# EAGLE board RFMicronHermes_1_1 (EAGLE 7.6.0), part 1 of 2
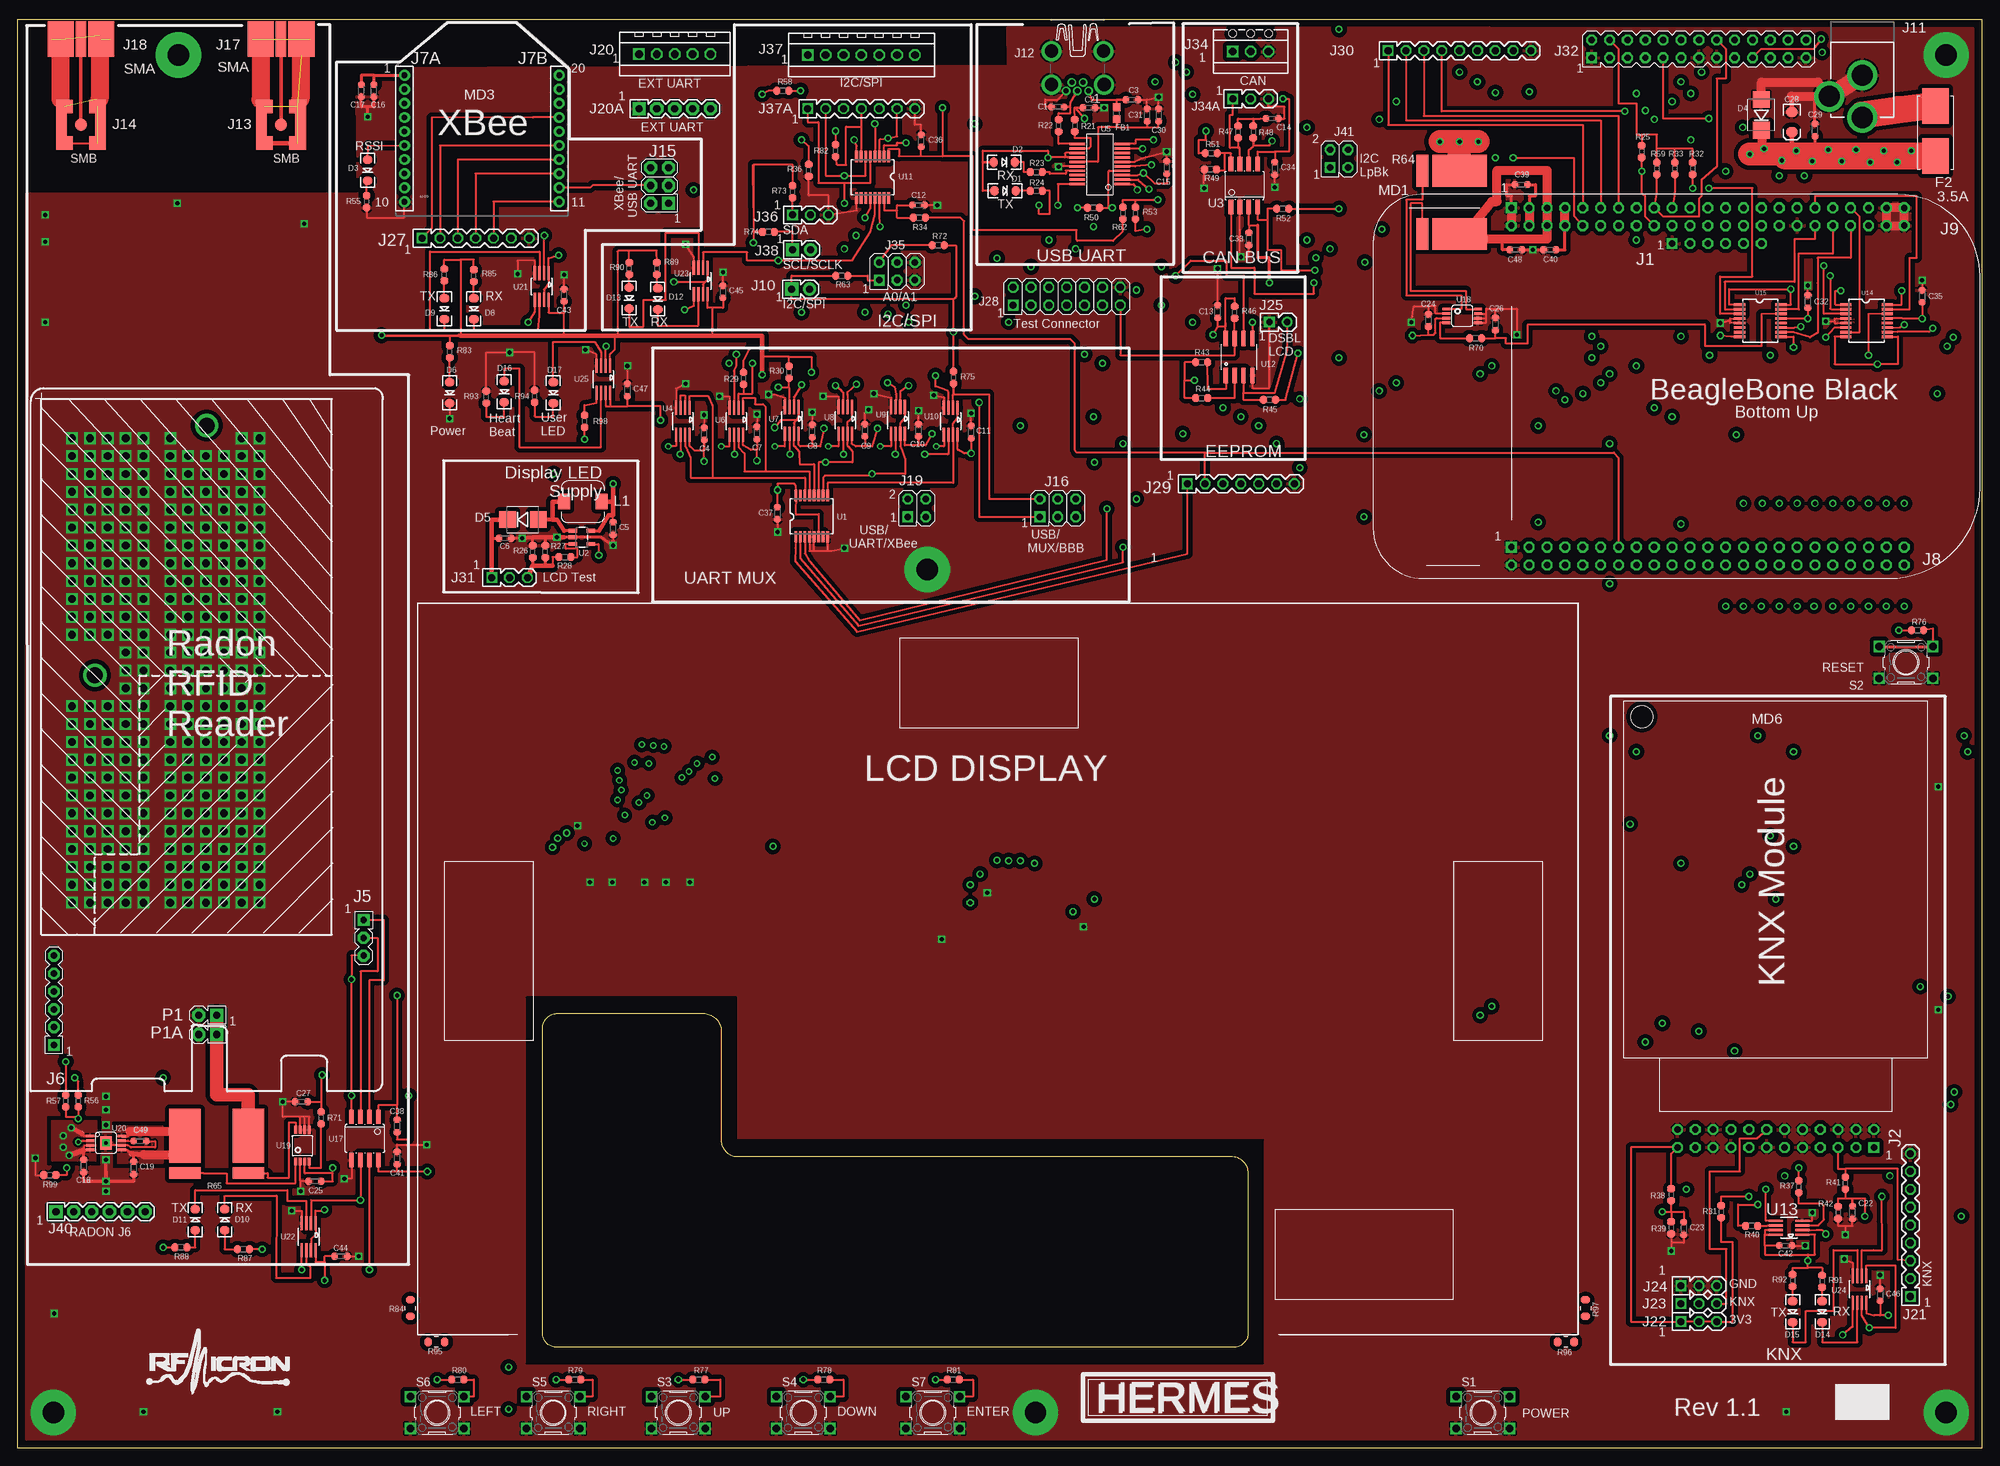
[diagram p9: board, top side]
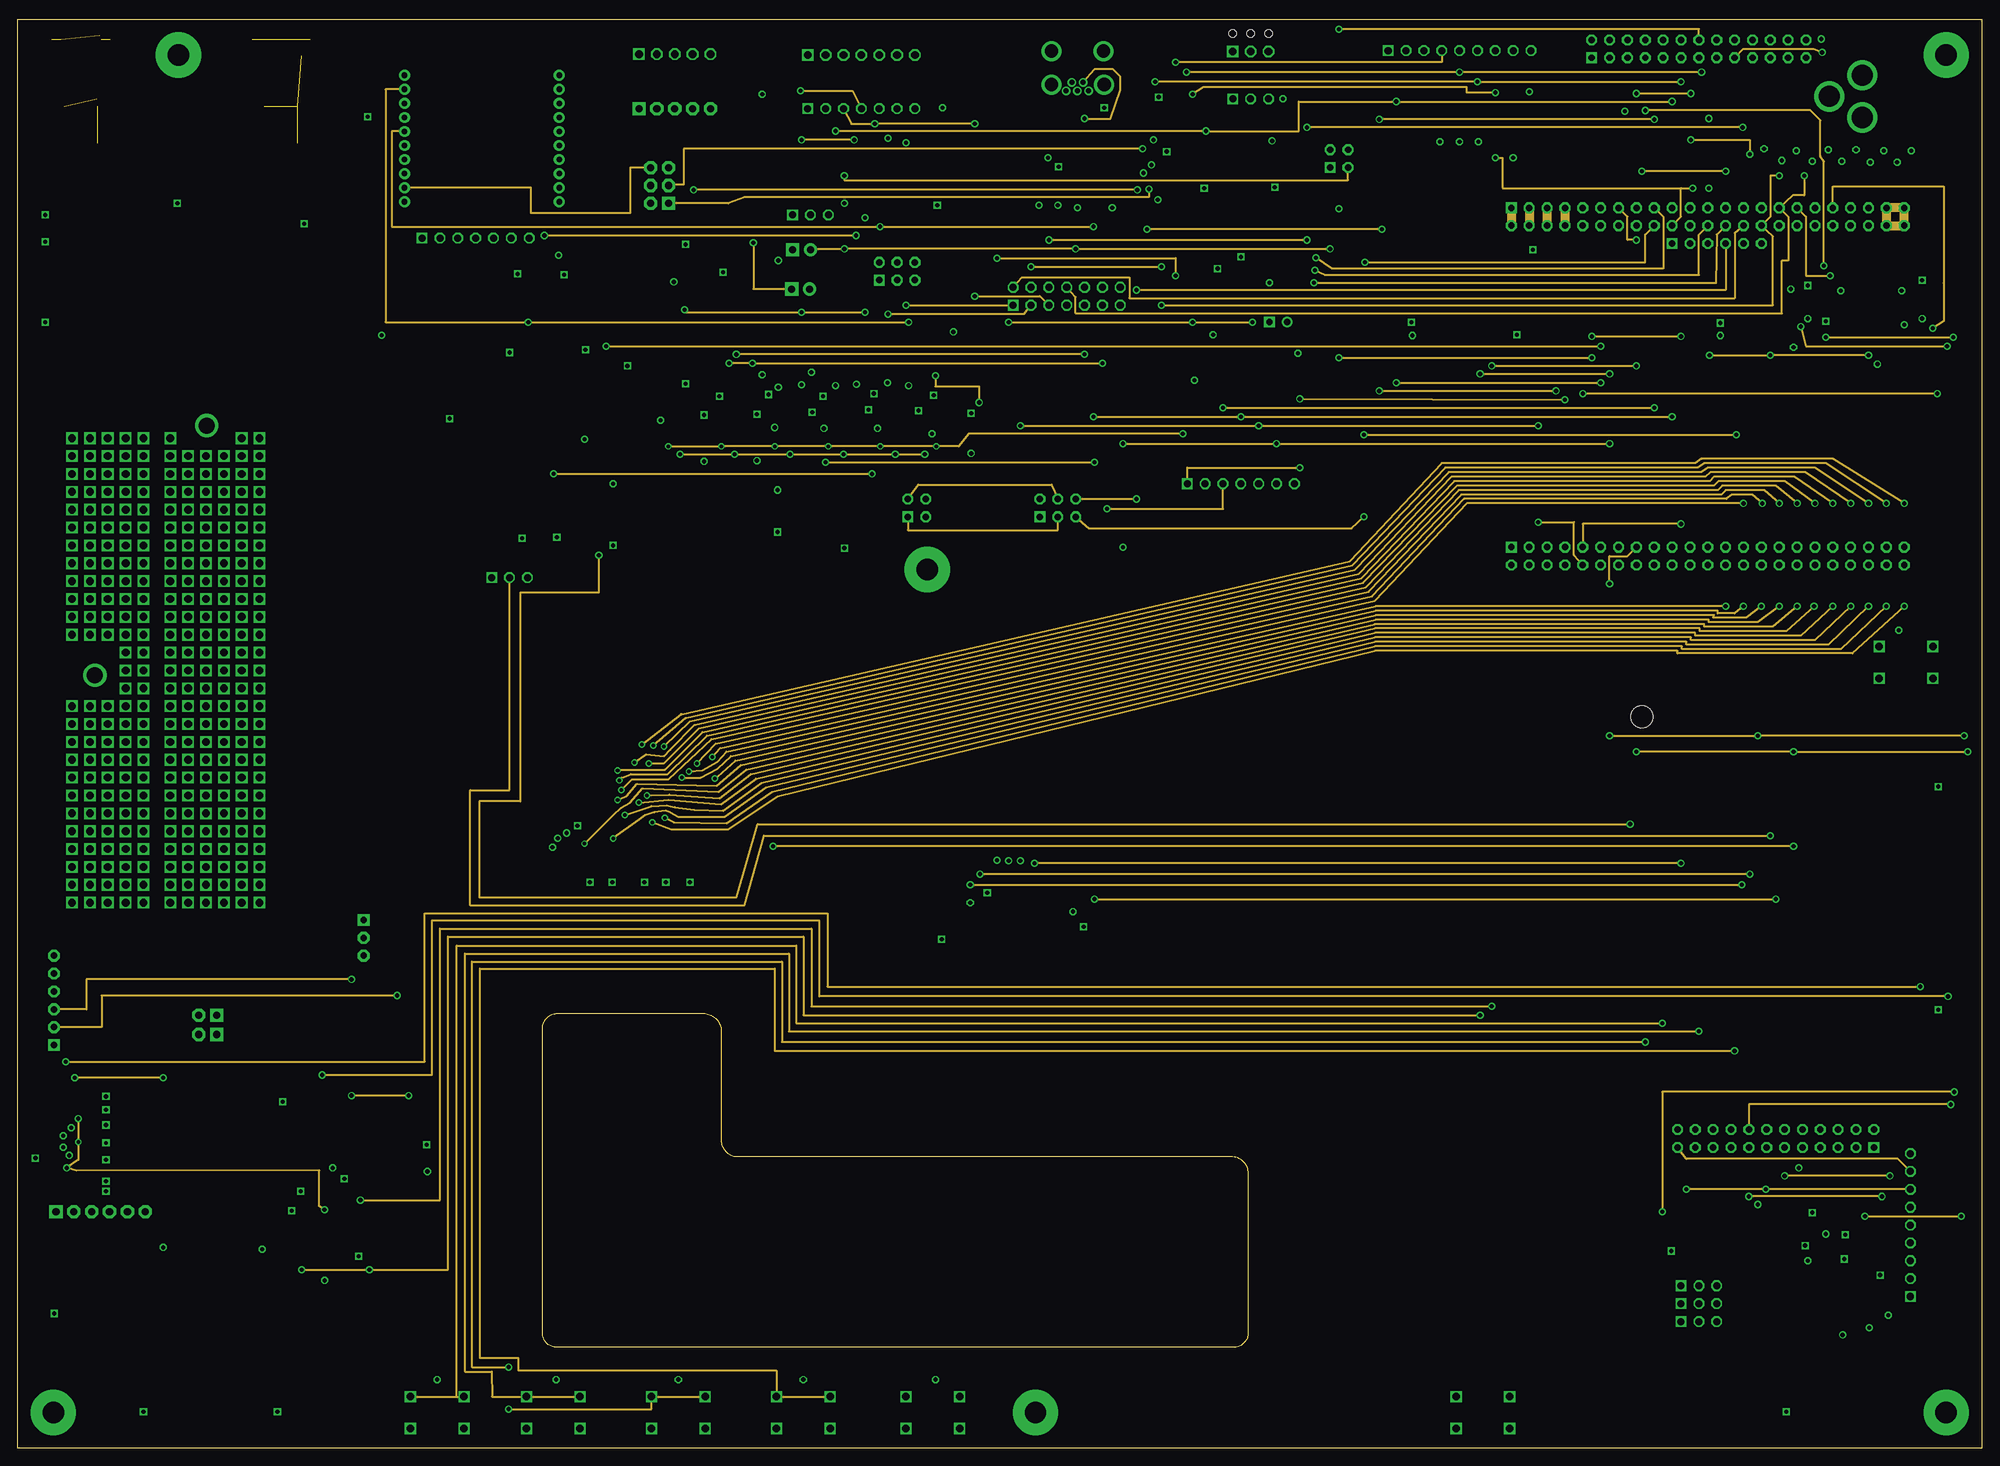
[diagram p10: board, inner layer SI1]
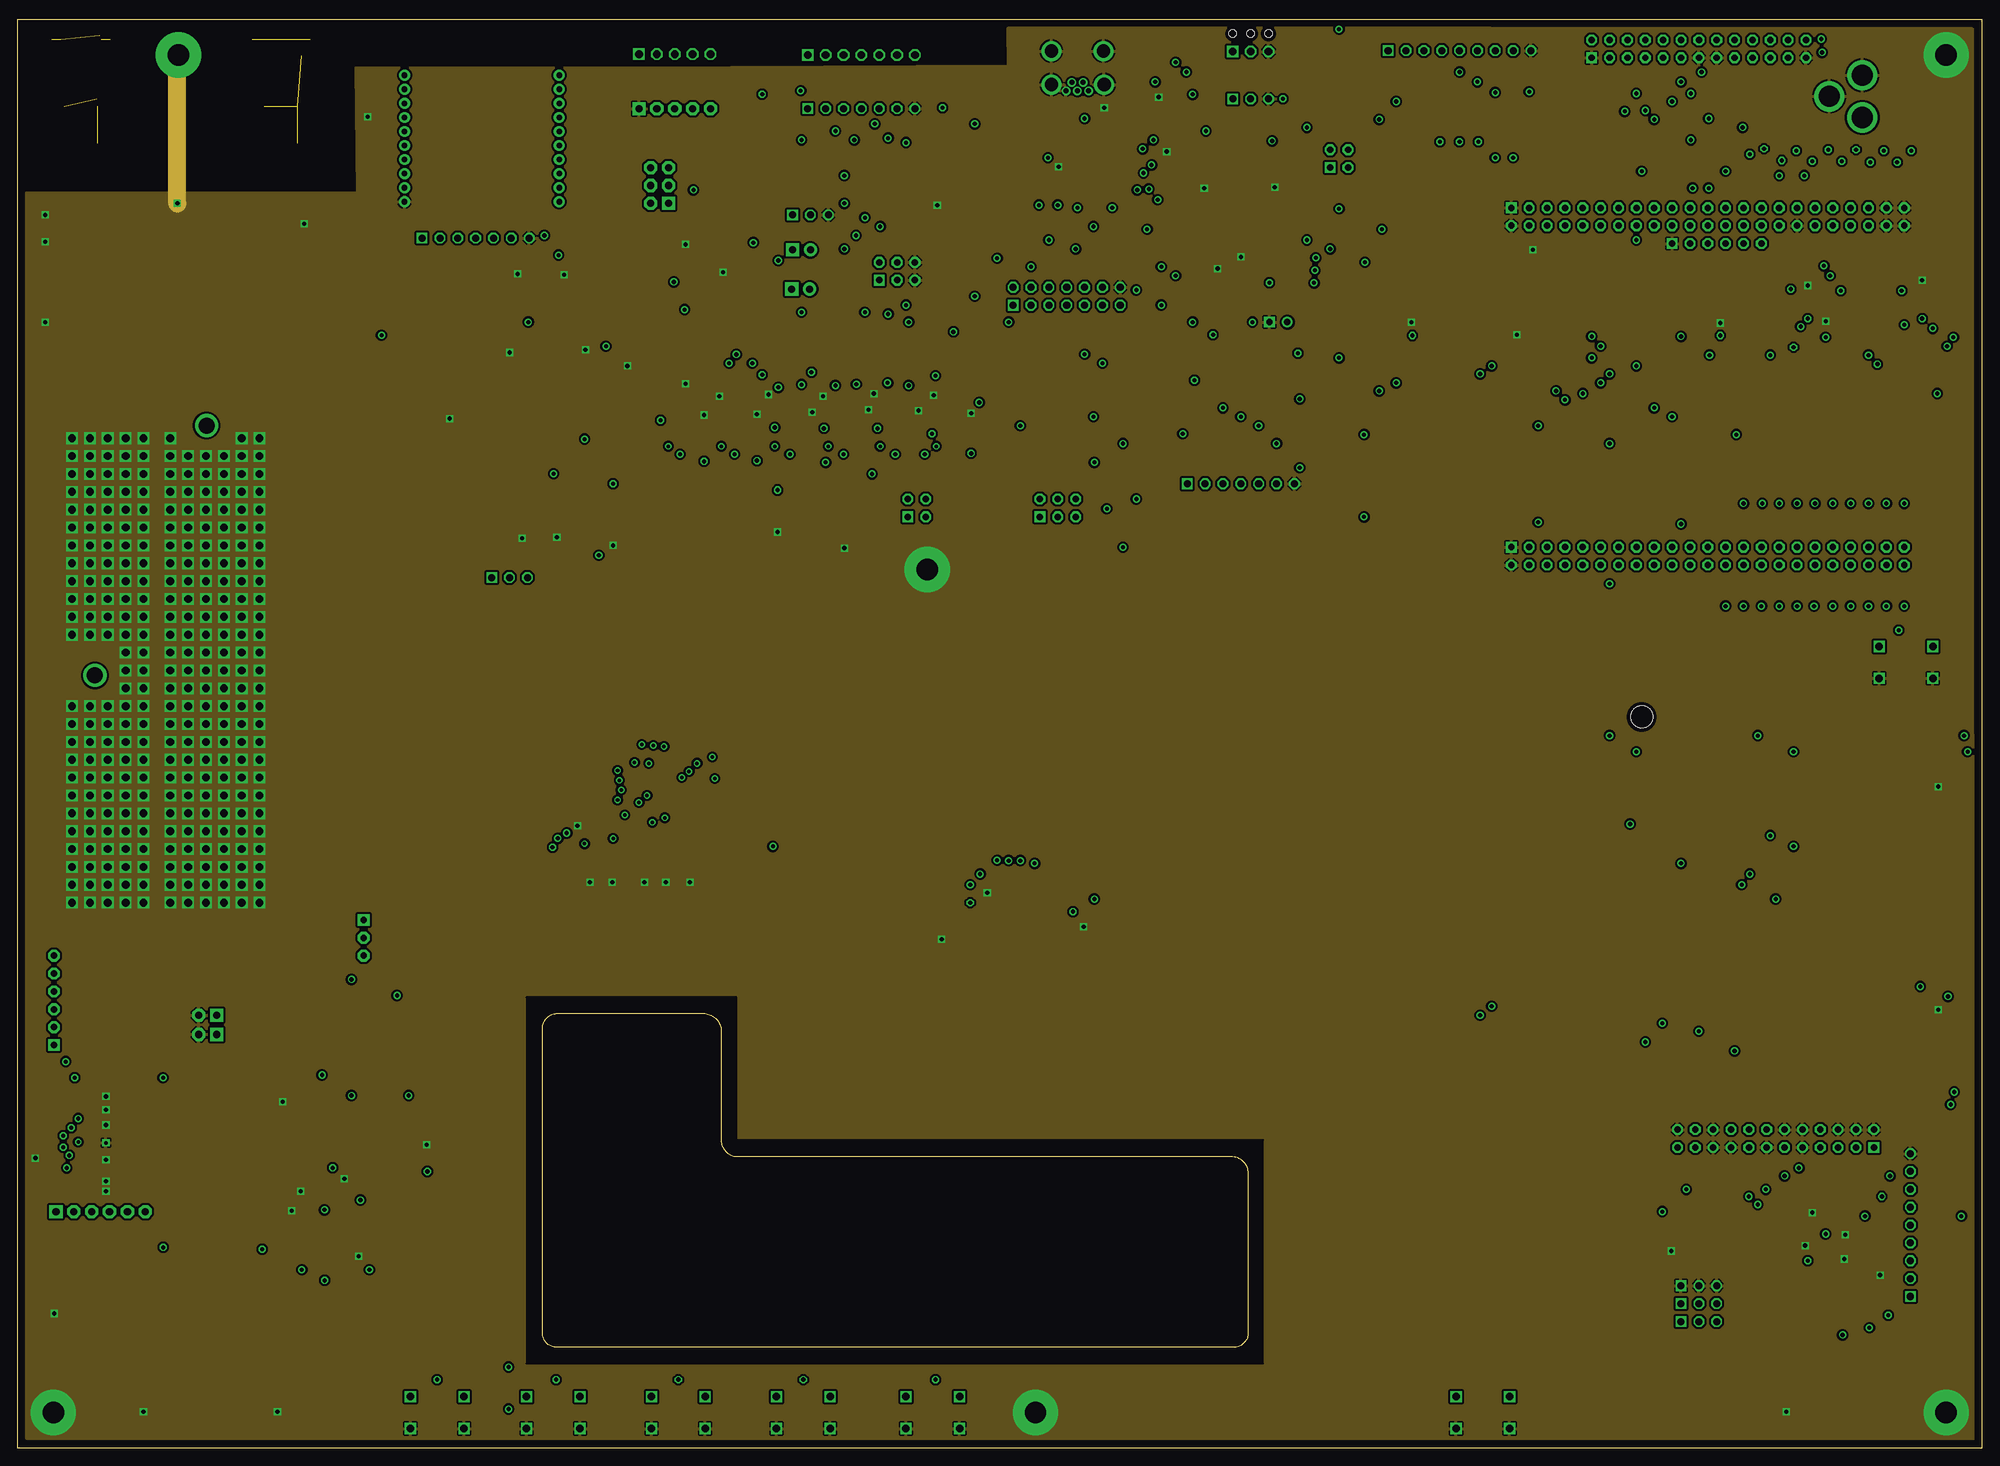
[diagram p11: board, inner layer GND]
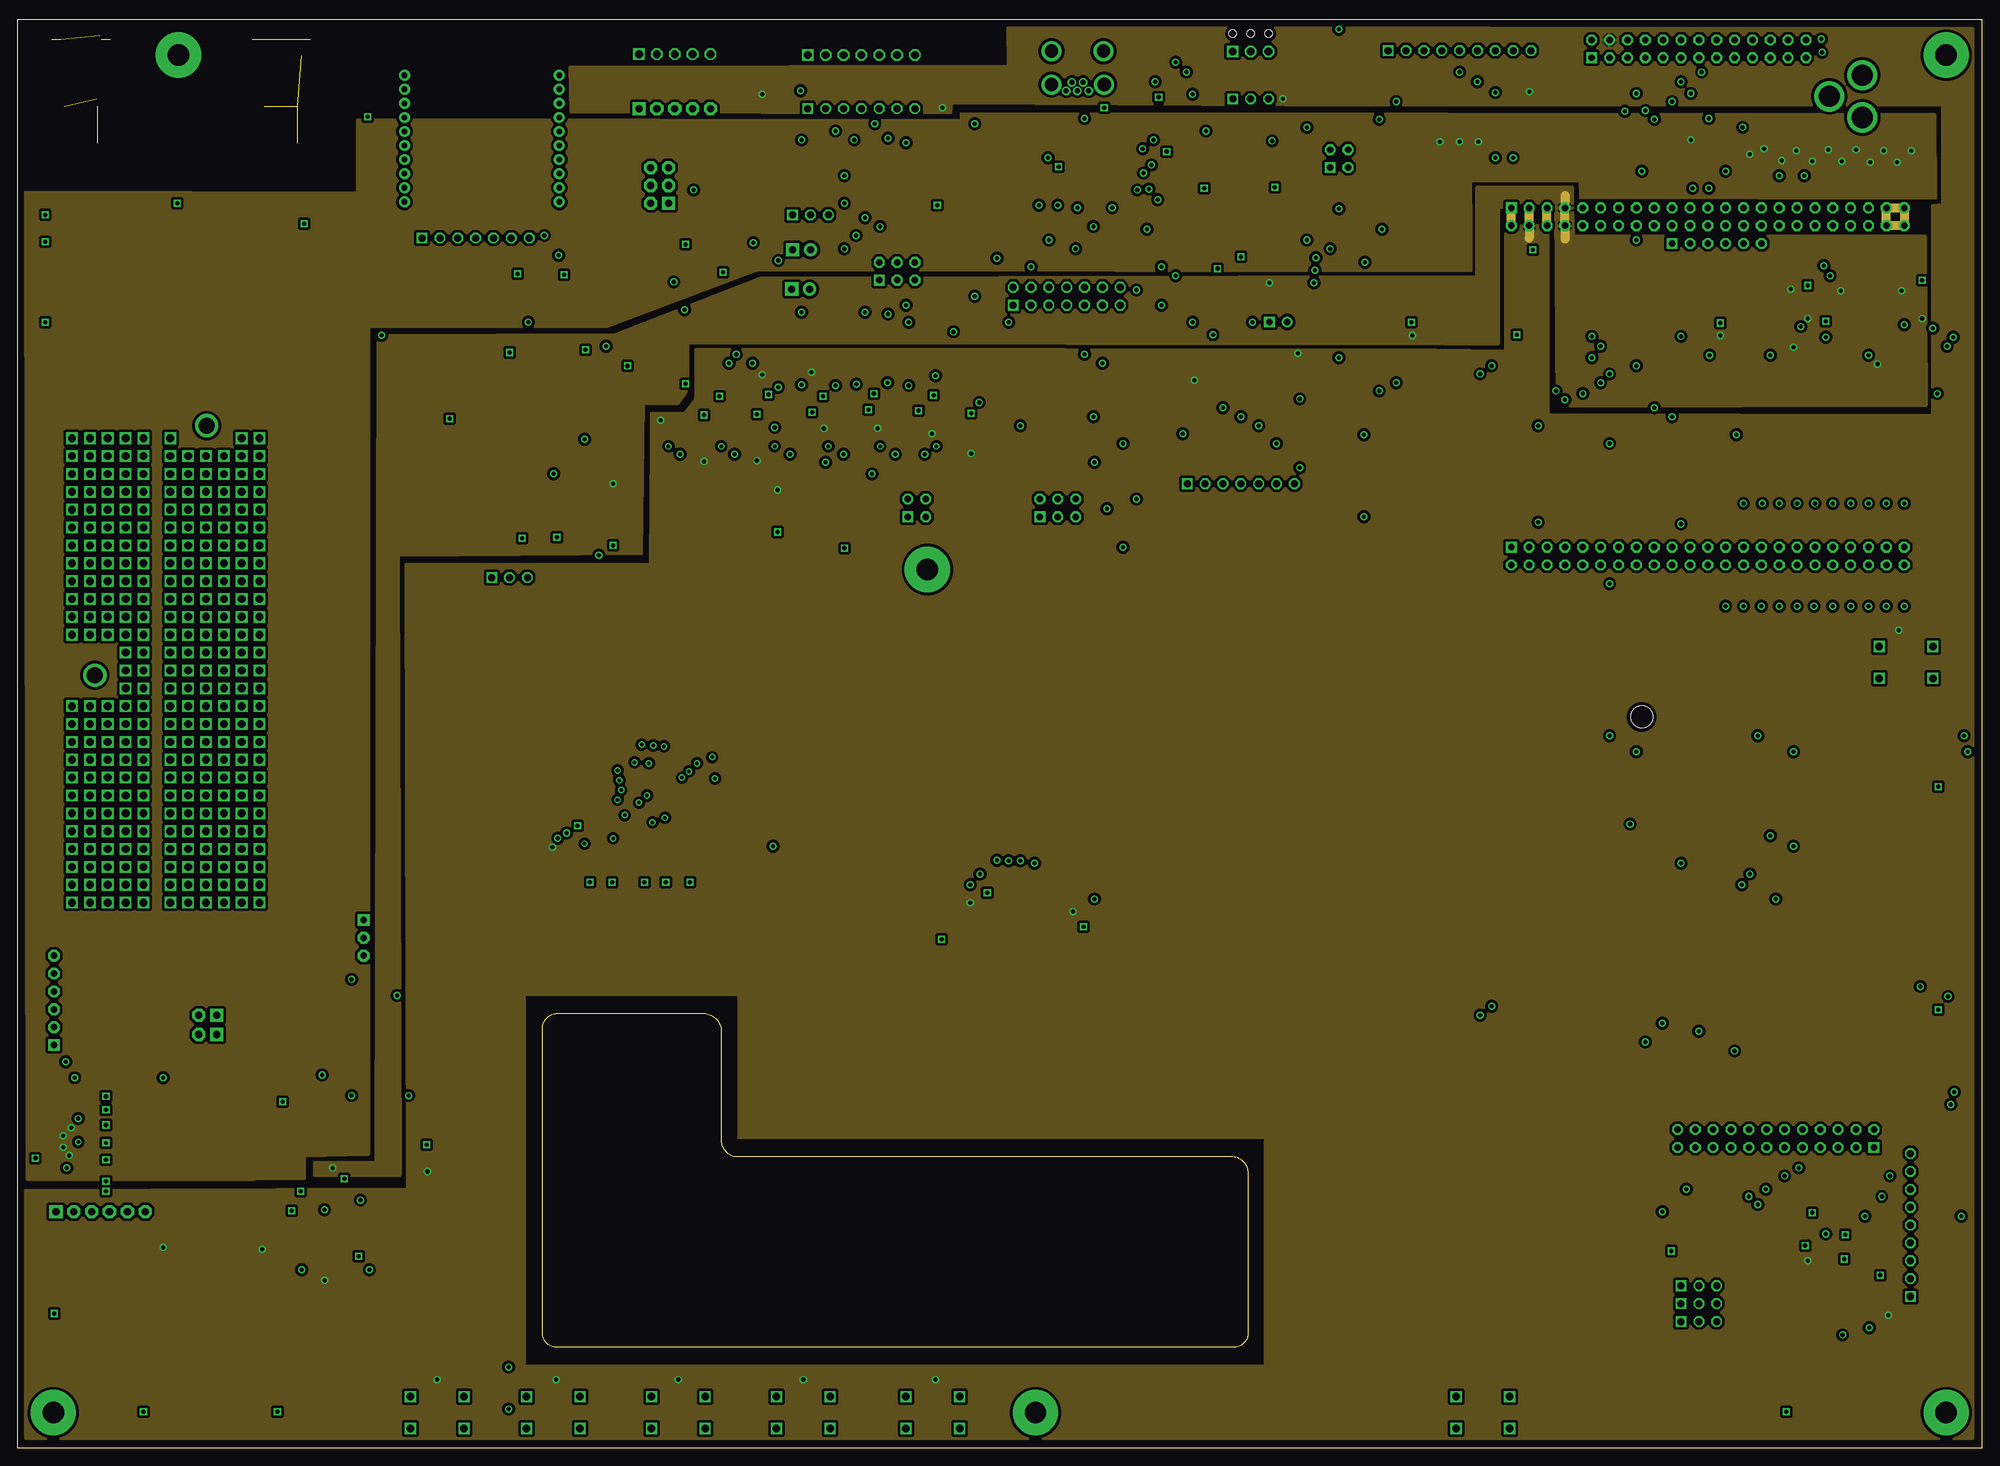
[diagram p12: board, inner layer PWR]
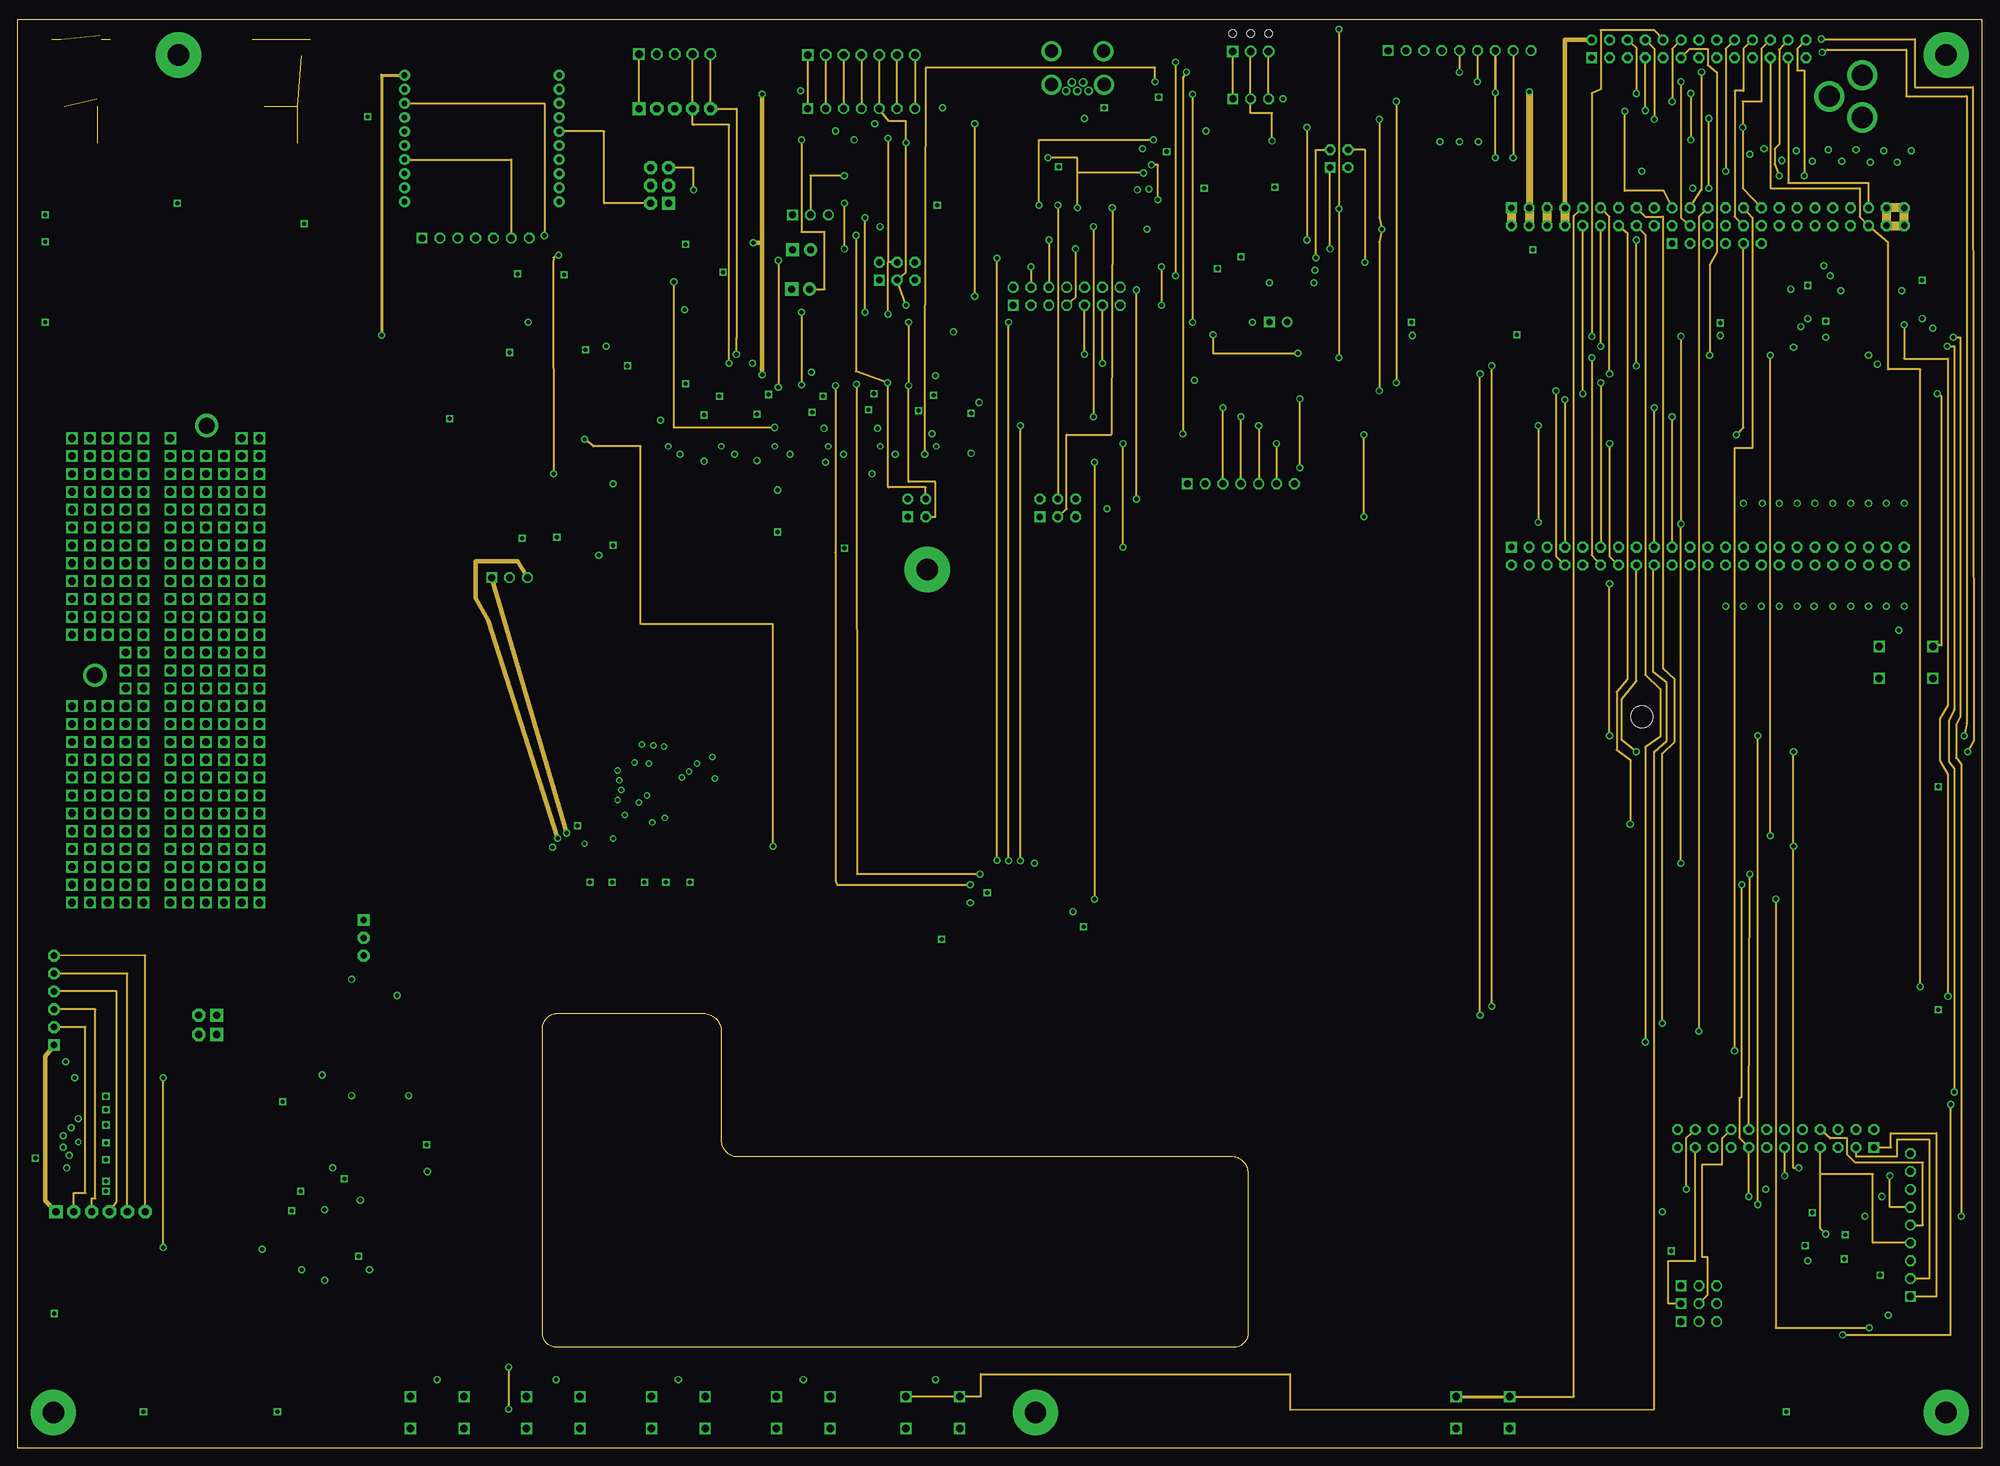
[diagram p13: board, inner layer SI2]
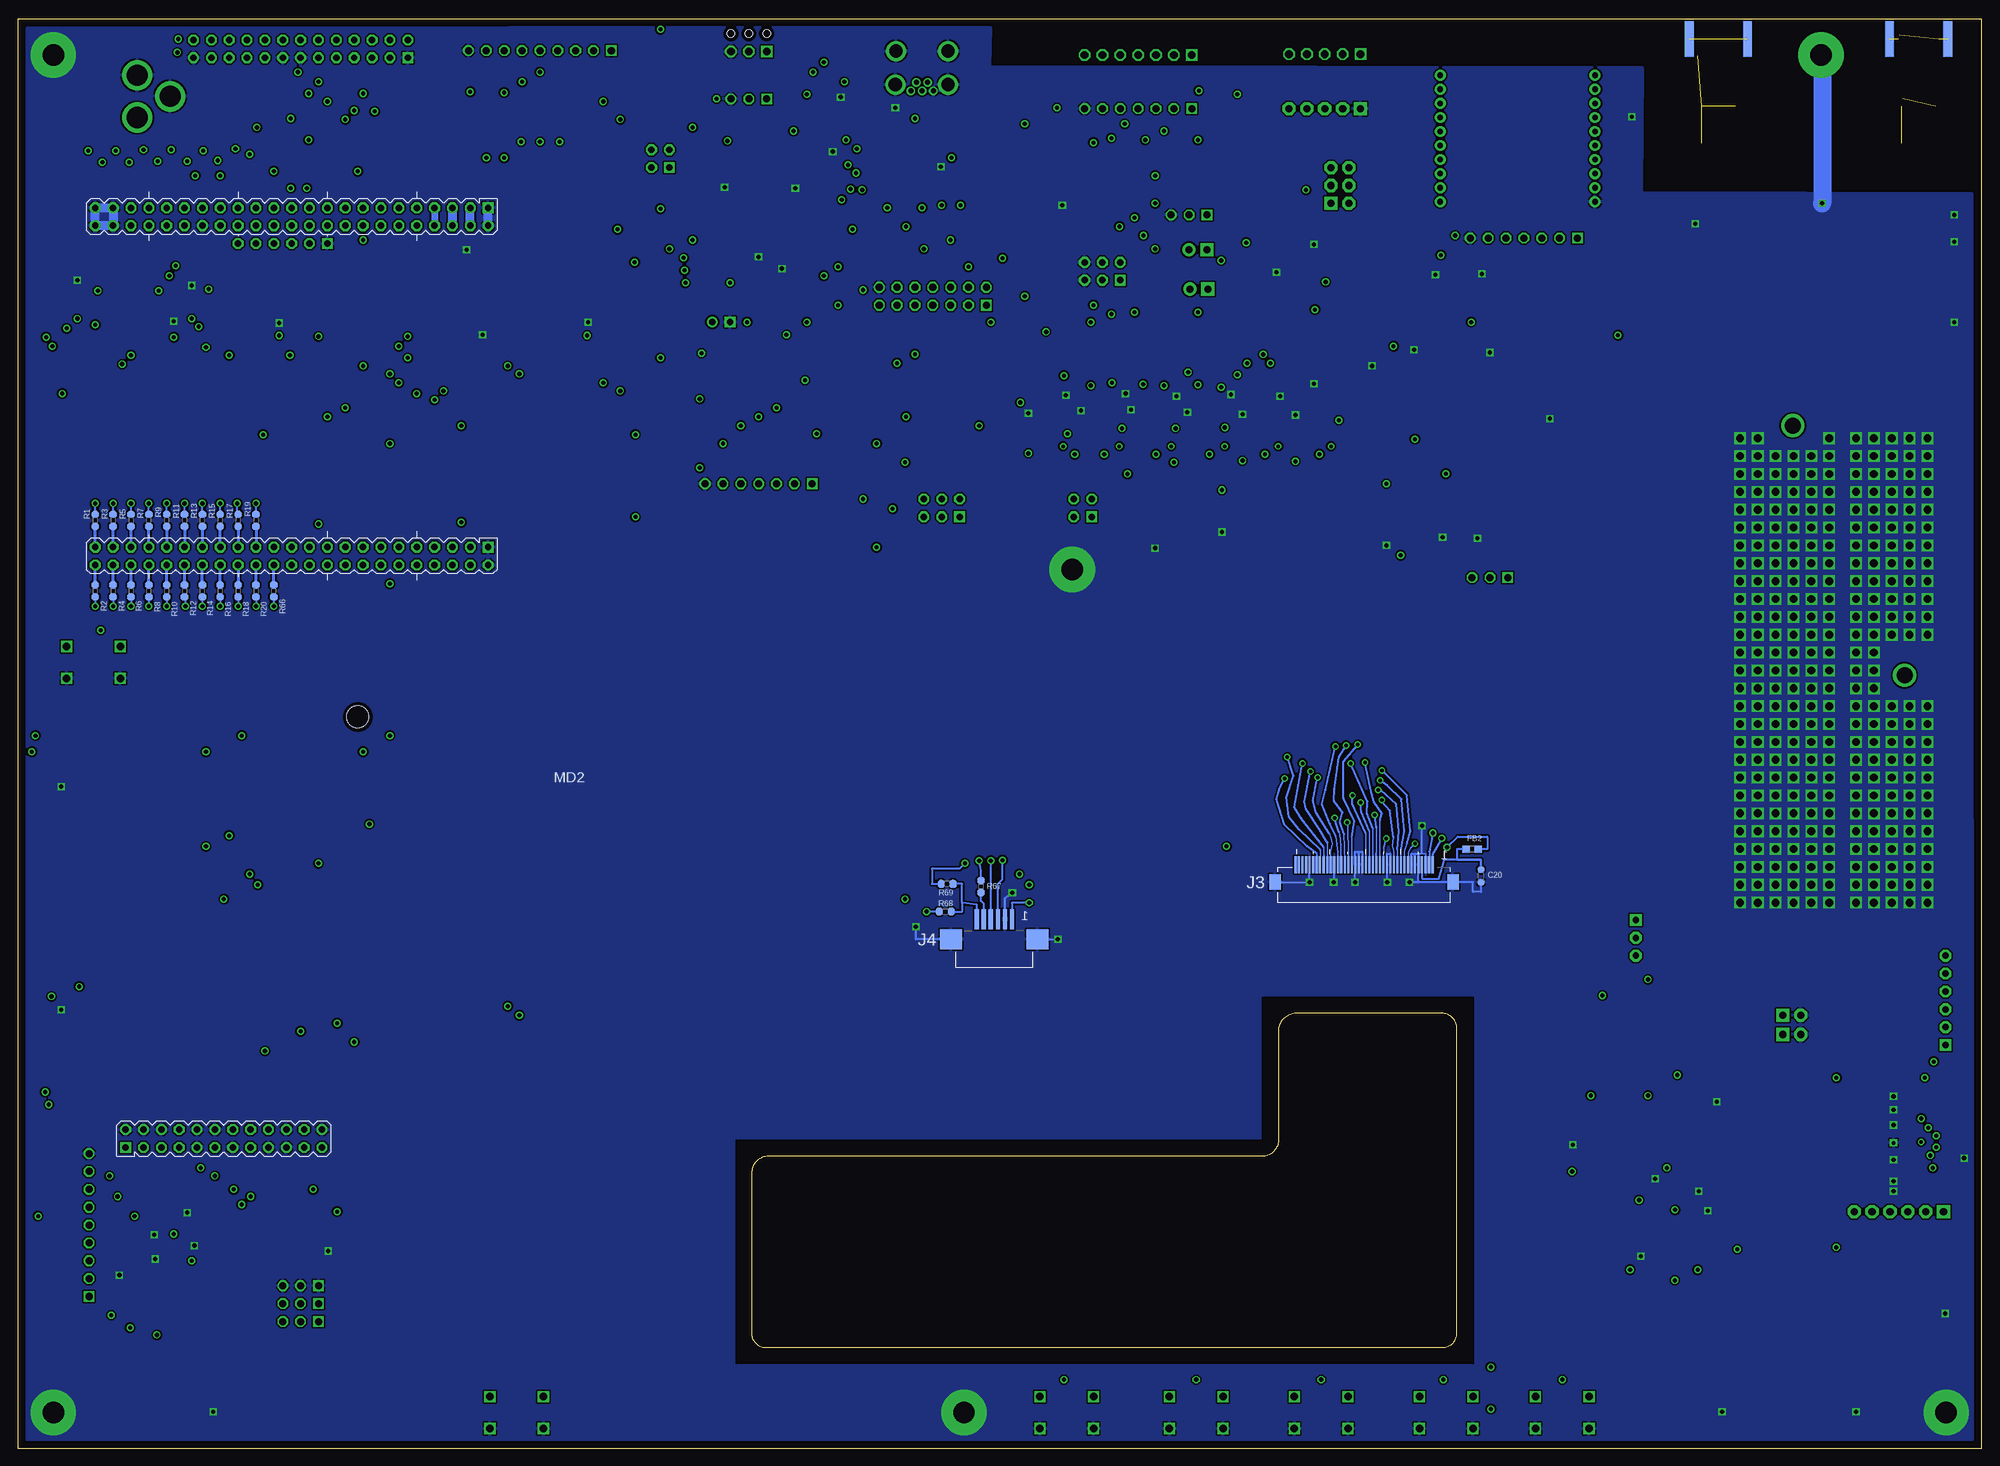
[diagram p14: board, bottom side, seen from below]

Size 279.4 x 203.2 mm. Coordinates in mm from the lower left corner, seen from the top.
Outline: 0,0 0,203.2 279.4,203.2 279.4,0 0,0
Copper layers (1*2+3*4+5*16): Top 0.035mm / dielectric 1.5mm / SI1 0.035mm / dielectric 0.15mm / GND 0.035mm / dielectric 0.2mm / PWR 0.035mm / dielectric 0.15mm / SI2 0.035mm / dielectric 0.2mm / Bottom 0.035mm
Design rules "default *": minimum track width 6mil, minimum drill 0.3mm, track to track 7mil, track to pad 7mil, pad to pad 7mil, via to via 7mil, smd to smd 7mil, copper to edge 20mil, drill to drill 8mil, minimum pad ring 10mil, minimum via ring 8mil, stop-mask expansion 6mil, vias tented up to drill 0mil, thermal gap 10mil

## Footprints (pad centres in the part's own frame; a part is rotated, then mirrored left to right if it is on the bottom)
C0603K = smd 0.95 x 1.05: 1 -0.875,0; 2 0.875,0
EIA3216 = smd 1.4 x 1.6: A 1.4,0; C -1.4,0
LED-1206 = smd 1.2 x 1.4: A -1.5,0; C 1.5,0
SC-110A-POWER_DIODE = smd 2.4 x 2.4: A 2.2,0; C -2.2,0
SMB-DIODE = smd 2.4 x 2.4: A 2.2,0; C -2.2,0
MTHOLE4-40 = drill 3.048 pad 6.452: 1 0,0
FUSE_OMNI-BLOCK-154 = smd 5 x 3.81: 1 -3.565,0; 2 3.565,0
0603 = smd 1.1 x 1: 1 -0.85,0; 2 0.85,0
1X2 = drill 1.016 pad 1.88 square: 1 -1.27,0 | drill 1.016 pad 1.88: 2 1.27,0
POWER_JACK_PTH = drill 2.997 pad 4.318: 1 0,13.7; 2 0,7.7; 3 4.7,10.7
USBMINI-TH = drill 0.7: 1 1.6,-0.9; 2 0.8,0.3; 3 0,-0.9; 4 -0.8,0.3; 5 -1.6,-0.9 | drill 1.9 pad 2.54: 6 -3.7,0; 7 -3.7,4.75; 8 3.7,4.75; 9 3.8,0
SMB-SMD = smd 1.73 x 1.73: 1 0,0 | smd 2.35 x 1.9: 2 -2.375,-2.6; 3 2.375,-2.6; 4 2.375,2.6; 5 -2.375,2.6 | smd 1.5 x 3.4: 2@5 -2.8,0; 2@6 2.8,0
2X3 = drill 1.016 pad 1.88 square: 1 -2.54,-1.27 | drill 1.016 pad 1.88 octagon: 2 -2.54,1.27; 3 0,-1.27; 4 0,1.27; 5 2.54,-1.27; 6 2.54,1.27
2X3SM = drill 0.914 pad 1.524 square: 1 -2.54,-1.27 | drill 0.914 pad 1.524 octagon: 2 -2.54,1.27; 3 0,-1.27; 4 0,1.27; 5 2.54,-1.27; 6 2.54,1.27
SMA-EDGE = smd 5.08 x 1.524: 1 0,0 | smd 5.08 x 3.746: 2 0,2.889; 3 0,-2.889 | smd 5.08 x 1.27 bottom: 4 0,4.128; 5 0,-4.128
2X2SM = drill 0.914 pad 1.524 square: 1 -1.27,-1.27 | drill 0.914 pad 1.524 octagon: 2 -1.27,1.27; 3 1.27,-1.27; 4 1.27,1.27
PHOENIX1725685-5 = drill 1.1 pad 1.422 square: 1 0,0 | drill 1.1 pad 1.5 octagon: 2 2.54,0; 3 5.08,0; 4 7.62,0; 5 10.16,0
1X05 = drill 1.016 pad 1.88 square: 1 -5.08,0 | drill 1.016 pad 1.88 octagon: 2 -2.54,0; 3 0,0; 4 2.54,0; 5 5.08,0
1X09-SPECIAL = drill 1 pad 1.422 square: 1 -10.16,0 | drill 1 pad 1.422 octagon: 2 -7.62,0; 3 -5.08,0; 4 -2.54,0; 5 0,0; 6 2.54,0; 7 5.08,0; 8 7.62,0; 9 10.16,0
1X03-SPECIAL = drill 1 pad 1.422 square: 1 -3.81,0 | drill 1 pad 1.422 octagon: 2 -1.27,0; 3 1.27,0
1X2SM = drill 0.914 pad 1.524 square: 1 -1.27,0 | drill 0.914 pad 1.524: 2 1.27,0
1X07-SPECIAL = drill 1 pad 1.422 square: 1 -6.35,0 | drill 1 pad 1.422 octagon: 2 -3.81,0; 3 -1.27,0; 4 1.27,0; 5 3.81,0; 6 6.35,0; 7 8.89,0
2X7SM = drill 1.016 pad 1.524 square: 1 -8.89,-1.27 | drill 1.016 pad 1.524 octagon: 2 -8.89,1.27; 3 -6.35,-1.27; 4 -6.35,1.27; 5 -3.81,-1.27; 6 -3.81,1.27; 7 -1.27,-1.27; 8 -1.27,1.27; 9 1.27,-1.27; 10 1.27,1.27; 11 3.81,-1.27; 12 3.81,1.27; 13 6.35,-1.27; 14 6.35,1.27
2X13-SM = drill 0.914 pad 1.524 square: 1 -13.97,-1.27 | drill 0.914 pad 1.524 octagon: 2 -13.97,1.27; 3 -11.43,-1.27; 4 -11.43,1.27; 5 -8.89,-1.27; 6 -8.89,1.27; 7 -6.35,-1.27; 8 -6.35,1.27; 9 -3.81,-1.27; 10 -3.81,1.27; 11 -1.27,-1.27; 12 -1.27,1.27; 13 1.27,-1.27; 14 1.27,1.27; 15 3.81,-1.27; 16 3.81,1.27; 17 6.35,-1.27; 18 6.35,1.27; 19 8.89,-1.27; 20 8.89,1.27; 21 11.43,-1.27; 22 11.43,1.27; 23 13.97,-1.27; 24 13.97,1.27; 25 16.51,-1.27; 26 16.51,1.27
PHOENIX1725669-3 = drill 1.1 pad 1.422 square: 1 0,0 | drill 1.1 pad 1.5 octagon: 2 2.54,0; 3 5.08,0 | hole 1.1: 0,2.54; 2.54,2.54; 5.08,2.54
PHOENIX1725708-7 = drill 1.1 pad 1.5 square: 1 0,0 | drill 1.1 pad 1.5 octagon: 2 2.54,0; 3 5.08,0; 4 7.62,0; 5 10.16,0; 6 12.7,0; 7 15.24,0
1X06 = drill 1.016 pad 1.88 square: 1 0,0 | drill 1.016 pad 1.88 octagon: 2 2.54,0; 3 5.08,0; 4 7.62,0; 5 10.16,0; 6 12.7,0
TDK_CA = smd 1.7 x 2.2: 1 -2.65,0; 2 2.65,0
BBONE_BK = drill 0.914 pad 1.524 square: 1 19.685,4.445; `1 42.545,47.625; ~1 19.685,52.705 | drill 0.914 pad 1.524 octagon: 2 19.685,1.905; 3 22.225,4.445; 4 22.225,1.905; 5 24.765,4.445; 6 24.765,1.905; 7 27.305,4.445; 8 27.305,1.905; 9 29.845,4.445; 10 29.845,1.905; 11 32.385,4.445; 12 32.385,1.905; 13 34.925,4.445; 14 34.925,1.905; 15 37.465,4.445; 16 37.465,1.905; 17 40.005,4.445; 18 40.005,1.905; 19 42.545,4.445; 20 42.545,1.905; 21 45.085,4.445; 22 45.085,1.905; 23 47.625,4.445; 24 47.625,1.905; 25 50.165,4.445; 26 50.165,1.905; 27 52.705,4.445; 28 52.705,1.905; 29 55.245,4.445; 30 55.245,1.905; 31 57.785,4.445; 32 57.785,1.905; 33 60.325,4.445; 34 60.325,1.905; 35 62.865,4.445; 36 62.865,1.905; 37 65.405,4.445; 38 65.405,1.905; 39 67.945,4.445; 40 67.945,1.905; 41 70.485,4.445; 42 70.485,1.905; 43 73.025,4.445; 44 73.025,1.905; 45 75.565,4.445; 46 75.565,1.905; `2 45.085,47.625; `3 47.625,47.625; `4 50.165,47.625; `5 52.705,47.625; `6 55.245,47.625; ~2 19.685,50.165; ~3 22.225,52.705; ~4 22.225,50.165; ~5 24.765,52.705; ~6 24.765,50.165; ~7 27.305,52.705; ~8 27.305,50.165; ~9 29.845,52.705; ~10 29.845,50.165; ~11 32.385,52.705; ~12 32.385,50.165; ~13 34.925,52.705; ~14 34.925,50.165; ~15 37.465,52.705; ~16 37.465,50.165; ~17 40.005,52.705; ~18 40.005,50.165; ~19 42.545,52.705; ~20 42.545,50.165; ~21 45.085,52.705; ~22 45.085,50.165; ~23 47.625,52.705; ~24 47.625,50.165; ~25 50.165,52.705; ~26 50.165,50.165; ~27 52.705,52.705; ~28 52.705,50.165; ~29 55.245,52.705; ~30 55.245,50.165; ~31 57.785,52.705; ~32 57.785,50.165; ~33 60.325,52.705; ~34 60.325,50.165; ~35 62.865,52.705; ~36 62.865,50.165; ~37 65.405,52.705; ~38 65.405,50.165; ~39 67.945,52.705; ~40 67.945,50.165; ~41 70.485,52.705; ~42 70.485,50.165; ~43 73.025,52.705; ~44 73.025,50.165; ~45 75.565,52.705; ~46 75.565,50.165
NEWHAVEN_LCD_NHD-7.0-800480EF = smd 0.305 x 2.4 bottom: 1 21.241,66.858; 2 21.724,66.858; 3 22.232,66.858; 4 22.74,66.858; 5 23.222,66.858; 6 23.73,66.858; 7 24.238,66.858; 8 24.721,66.858; 9 25.229,66.858; 10 25.737,66.858; 11 26.241,66.858; 12 26.724,66.858; 13 27.232,66.858; 14 27.74,66.858; 15 28.222,66.858; 16 28.73,66.858; 17 29.238,66.858; 18 29.721,66.858; 19 30.229,66.858; 20 30.737,66.858; 21 31.219,66.858; 22 31.727,66.858; 23 32.235,66.858; 24 32.718,66.858; 25 33.226,66.858; 26 33.734,66.858; 27 34.242,66.858; 28 34.725,66.858; 29 35.233,66.858; 30 35.741,66.858; 31 36.223,66.858; 32 36.731,66.858; 33 37.239,66.858; 34 37.722,66.858; 35 38.23,66.858; 36 38.738,66.858; 37 39.22,66.858; 38 39.728,66.858; 39 40.236,66.858; 40 40.719,66.858 | smd 1.6 x 2.21 bottom: 41 18.32,64.395; 42 43.64,64.395 | smd 0.6 x 2.9 bottom: ~1 81.07,59.108; ~2 82.07,59.108; ~3 83.07,59.108; ~4 84.07,59.108; ~5 85.07,59.108; ~6 86.07,59.108 | smd 3.1 x 2.8 bottom: ~7 77.42,56.258; ~8 89.72,56.258
XBEE-2 = drill 0.8 pad 1.524: 1 -11,6.03; 2 -11,4.03; 3 -11,2.03; 4 -11,0.03; 5 -11,-1.97; 6 -11,-3.97; 7 -11,-5.97; 8 -11,-7.97; 9 -11,-9.97; 10 -11,-11.97; 11 11,-11.97; 12 11,-9.97; 13 11,-7.97; 14 11,-5.97; 15 11,-3.97; 16 11,-1.97; 17 11,0.03; 18 11,2.03; 19 11,4.03; 20 11,6.03
RADON_RFID_READ = drill 0.914 pad 1.676 square: 1 93.396,3.277; `1 75.616,47.32 | drill 0.914 pad 1.676 octagon: 2 90.856,3.277; 3 88.316,3.277; 4 85.776,3.277; 5 83.236,3.277; 6 80.696,3.277; `2 78.156,47.32; `3 80.696,47.32 | drill 2.286: P$1 5.309,24.994; P$2 40.818,9.093 | drill 1.016 pad 1.88 square: ~1 89.154,26.416; ~3 91.897,26.416 | drill 1.016 pad 1.88 octagon: ~2 89.154,23.876; ~4 91.897,23.876
KNX-1 = drill 0.914 pad 1.524 square: 1 -12.7,7.62 | drill 0.914 pad 1.524 octagon: 2 -10.16,7.62; 3 -12.7,10.16; 4 -10.16,10.16; 5 -12.7,12.7; 6 -10.16,12.7; 7 -12.7,15.24; 8 -10.16,15.24; 9 -12.7,17.78; 10 -10.16,17.78; 11 -12.7,20.32; 12 -10.16,20.32; 13 -12.7,22.86; 14 -10.16,22.86; 15 -12.7,25.4; 16 -10.16,25.4; 17 -12.7,27.94; 18 -10.16,27.94; 19 -12.7,30.48; 20 -10.16,30.48; 21 -12.7,33.02; 22 -10.16,33.02; 23 -12.7,35.56; 24 -10.16,35.56 | hole 3.175: 48.514,40.64
R0603 = smd 1 x 1.1: 1 -0.85,0; 2 0.85,0
RESIST_4-TERM_VISHAY = smd 4.5 x 7.71: 1 -4.51,0; 2 4.51,0 | smd 4.5 x 1.68: 3 -4.51,5.305; 4 4.51,5.305
0805-RES = smd 1.05 x 1.3: 1 -1.175,0; 2 1.175,0
EVQ-PAC04M = drill 1.067 square: 1 -3.81,2.261; 2 3.81,2.261; 3 -3.81,-2.261; 4 3.81,-2.261
TSSOP16 = smd 0.4 x 1.6: 1 -2.225,-2.85; 2 -1.575,-2.85; 3 -0.925,-2.85; 4 -0.275,-2.85; 5 0.375,-2.85; 6 1.025,-2.85; 7 1.675,-2.85; 8 2.325,-2.85; 9 2.325,3.05; 10 1.675,3.05; 11 1.025,3.05; 12 0.375,3.05; 13 -0.275,3.05; 14 -0.925,3.05; 15 -1.575,3.05; 16 -2.225,3.05
TSOT-23-5 = smd 0.55 x 1.2: 1 -0.95,-1.3; 2 0,-1.3; 3 0.95,-1.3; 4 0.95,1.3; 5 -0.95,1.3
SOIC08 = smd 0.66 x 2.032: 1 -1.905,-3.073; 2 -0.635,-3.073; 3 0.635,-3.073; 4 1.905,-3.073; 5 1.905,3.073; 6 0.635,3.073; 7 -0.635,3.073; 8 -1.905,3.073
SM8-TI-A = smd 0.3 x 2: 1 -0.975,-1.9; 2 -0.325,-1.9; 3 0.325,-1.9; 4 0.975,-1.9; 5 0.975,1.9; 6 0.325,1.9; 7 -0.325,1.9; 8 -0.975,1.9
SSOP20-.150 = smd 0.35 x 2.2: 1 -2.857,-3.2; 2 -2.223,-3.2; 3 -1.587,-3.2; 4 -0.953,-3.2; 5 -0.318,-3.2; 6 0.318,-3.2; 7 0.953,-3.2; 8 1.587,-3.2; 9 2.223,-3.2; 10 2.857,-3.2; 11 2.857,3.2; 12 2.223,3.2; 13 1.587,3.2; 14 0.953,3.2; 15 0.318,3.2; 16 -0.318,3.2; 17 -0.953,3.2; 18 -1.587,3.2; 19 -2.223,3.2; 20 -2.857,3.2
SO08 = smd 0.61 x 2.21: 1 -1.905,-2.616; 2 -0.635,-2.616; 3 0.635,-2.616; 4 1.905,-2.616; 5 1.905,2.616; 6 0.635,2.616; 7 -0.635,2.616; 8 -1.905,2.616
MSOP8 = smd 0.4 x 1.1: 1 -0.975,-2.25; 2 -0.325,-2.25; 3 0.325,-2.25; 4 0.975,-2.25; 5 0.975,2.25; 6 0.325,2.25; 7 -0.325,2.25; 8 -0.975,2.25
MSOP8-POWERPAD = smd 0.4 x 1.1: 1 -0.975,-2.25; 2 -0.325,-2.25; 3 0.325,-2.25; 4 0.975,-2.25; 5 0.975,2.25; 6 0.325,2.25; 7 -0.325,2.25; 8 -0.975,2.25 | smd 1.89 x 1.57: 9 0,0 | drill 0.5 square: 10 0,0

## Placement (x,y rotation side)
C1  47pF  [C0603K]  147.96,190.75 180 top
C2  47pF  [C0603K]  152.4,190.63 0 top
C3  10nF  [C0603K]  158.5,191.77 0 top
C4  0.1uF  [C0603K]  97.66,144.27 270 top
C5  4.7uF 10V  [C0603K]  84.71,130.81 270 top
C6  1uF 35V  [C0603K]  69.34,129.41 0 top
C7  0.1uF  [C0603K]  105.16,144.4 270 top
C8  0.1uF  [C0603K]  113.03,144.65 270 top
C9  0.1uF  [C0603K]  120.52,144.78 270 top
C10  0.1uF  [C0603K]  128.14,144.78 270 top
C11  0.1uF  [C0603K]  135.64,144.53 270 top
C12  DNP  [C0603K]  128.14,176.78 0 top
C13  0.1uF  [C0603K]  170.69,161.67 90 top
C14  4.7nF  [C0603K]  178.44,189.1 0 top
C15  100nF  [C0603K]  163.45,182.12 90 top
C16  8.2pF  [C0603K]  50.67,193.04 270 top
C17  1uF  [C0603K]  48.9,193.04 270 top
C18  4.7uF  [C0603K]  9.4,40.13 270 top
C19  0.1uF  [C0603K]  16.51,39.88 270 top
C20  0.01uF  [C0603K]  71.25,81.41 270 bottom
C22  DNP  [C0603K]  260.99,33.53 270 top
C23  DNP  [C0603K]  236.98,31.24 270 top
C24  0.1uF  [C0603K]  200.66,160.4 270 top
C25  0.1uF  [C0603K]  42.29,37.97 0 top
C26  DNP  [C0603K]  210.19,159.89 90 top
C27  DNP  [C0603K]  40.39,49.28 180 top
C28  10uF 16V  [EIA3216]  252.35,188.59 270 top
C29  0.1uF  [C0603K]  255.65,187.45 90 top
C30  4.7uF  [C0603K]  162.31,189.61 90 top
C31  0.1uF  [C0603K]  160.66,189.61 90 top
C32  0.1uF  [C0603K]  254.63,163.07 90 top
C33  0.1uF  [C0603K]  175.13,171.96 270 top
C34  0.1uF  [C0603K]  178.82,181.99 270 top
C35  0.1uF  [C0603K]  270.89,163.83 90 top
C36  0.1uF  [C0603K]  128.52,185.93 90 top
C37  0.1uF  [C0603K]  108.08,132.97 270 top
C38  47nF  [C0603K]  53.98,45.85 270 top
C39  0.1uF  [C0603K]  213.87,179.71 180 top
C40  0.1uF  [C0603K]  217.93,170.43 180 top
C41  47nF  [C0603K]  53.98,41.27 90 top
C42  100nF  [C0603K]  251.46,28.83 0 top
C43  0.1uF  [C0603K]  77.72,163.96 270 top
C44  0.1uF  [C0603K]  45.97,27.3 180 top
C45  0.1uF  [C0603K]  100.33,164.47 270 top
C46  0.1uF  [C0603K]  264.92,21.84 270 top
C47  0.1uF  [C0603K]  86.74,150.5 270 top
C48  0.1uF  [C0603K]  213.11,170.43 0 top
C49  4.7nF  [C0603K]  17.4,43.69 0 top
D1  TX  [LED-1206]  140.46,178.82 0 top
D2  RX  [LED-1206]  140.34,182.88 0 top
D3  GN  [LED-1206]  49.78,181.74 270 top
D4  DB2431200L  [SC-110A-POWER_DIODE]  248.03,189.61 90 top
D5  CMSH1-40  [SMB-DIODE]  71.88,132.08 0 top
D6  PWR  [LED-1206]  61.47,150.11 270 top
D8  RX  [LED-1206]  64.9,162.05 270 top
D9  TX  [LED-1206]  60.71,162.05 270 top
D10  RX  [LED-1206]  29.46,32.51 90 top
D11  TX  [LED-1206]  25.27,32.51 90 top
D12  RX  [LED-1206]  91.06,163.45 270 top
D13  TX  [LED-1206]  87,163.58 270 top
D14  RX  [LED-1206]  256.67,19.43 270 top
D15  TX  [LED-1206]  252.48,19.43 270 top
D16  HB  [LED-1206]  69.22,150.24 270 top
D17  USER_LED  [LED-1206]  76.2,150.11 270 top
E2  1  [MTHOLE4-40]  5.08,5.08 0 top
E3  1  [MTHOLE4-40]  274.32,5.08 0 top
E4  1  [MTHOLE4-40]  22.86,198.12 0 top
E5  1  [MTHOLE4-40]  274.32,198.12 0 top
E6  1  [MTHOLE4-40]  129.41,124.97 0 top
E7  1  [MTHOLE4-40]  144.78,5.08 0 top
F2  3.5A  [FUSE_OMNI-BLOCK-154]  272.8,187.32 270 top
FB1  BLM18KG601SN1D  [0603]  156.34,189.87 90 top
FB2  BLM18KG601SN1D  [0603]  72.52,85.22 180 bottom
J10  I2C/!SPI  [1X2]  111.38,164.85 0 top
J11  +5V  [POWER_JACK_PTH]  262.38,202.95 180 top
J12  USBMINI  [USBMINI-TH]  150.75,193.93 0 top
J13  SMB  [SMB-SMD]  37.47,188.21 0 top
J14  SMB  [SMB-SMD]  9.02,188.21 0 top
J15  XBeeCtrl  [2X3]  91.31,179.58 90 top
J16  [2X3SM]  147.96,133.73 0 top
J17  SMA  [SMA-EDGE]  37.47,200.41 90 top
J18  SMA  [SMA-EDGE]  9.02,200.41 90 top
J19  UART/XBee  [2X2SM]  127.89,133.73 0 top
J20  EXT_UART  [PHOENIX1725685-5]  88.39,198.25 0 top
J20A  EXT_UART  [1X05]  93.47,190.5 0 top
J21  KNX DNP  [1X09-SPECIAL]  269.24,31.75 90 top
J22  KNX3V3  [1X03-SPECIAL]  240.41,18.03 0 top
J23  KNX  [1X03-SPECIAL]  240.41,20.57 0 top
J24  KNXGND  [1X03-SPECIAL]  240.41,23.11 0 top
J25  DSBL LCD  [1X2SM]  179.32,160.15 0 top
J27  XBee DNP  [1X07-SPECIAL]  63.88,172.09 0 top
J28  Test Connector  [2X7SM]  150.5,163.83 0 top
J29  TP-J8 DNP  [1X07-SPECIAL]  172.72,137.16 0 top
J30  TP-J9 DNP  [1X09-SPECIAL]  205.1,198.75 0 top
J31  LCD_Test  [1X03-SPECIAL]  71.25,123.83 0 top
J32  HEADER A  [2X13-SM]  237.87,199.01 0 top
J34  CAN  [PHOENIX1725669-3]  172.85,198.63 0 top
J34A  CAN DNP  [1X03-SPECIAL]  176.66,191.9 0 top
J35  A0/A1  [2X3SM]  125.09,167.39 0 top
J36  SDA  [1X03-SPECIAL]  114.05,175.39 0 top
J37  I2C/SPI  [PHOENIX1725708-7]  112.39,198.12 0 top
J37A  I2C/SPI DNP  [1X07-SPECIAL]  118.75,190.5 0 top
J38  SCL/SCLK  [1X2]  111.51,170.43 0 top
J40  READER  [1X06]  5.46,33.66 0 top
J41  LpBk B  [2X2SM]  187.96,183.39 0 top
L1  CLF6045T-220M-D  [TDK_CA]  80.39,134.62 180 top
MD1  BeagleBone Black  [BBONE_BK]  192.79,123.7 0 top
MD2  NHD-7.0-800480EF  [NEWHAVEN_LCD_NHD-7.0-800480EF]  56.9,16.13 0 top
MD3  XBEE-2A  [XBEE-2]  66.04,189.23 0 top
MD5  READER  [RADON_RFID_READ]  1.91,150.75 270 top
MD6  KNX-2  [KNX-1]  271.65,55.5 90 top
R1  33  [R0603]  268.35,131.95 270 bottom
R2  33  [R0603]  268.35,121.92 270 bottom
R3  33  [R0603]  265.81,131.95 270 bottom
R4  33  [R0603]  265.81,121.92 270 bottom
R5  33  [R0603]  263.27,131.95 270 bottom
R6  33  [R0603]  263.27,121.92 270 bottom
R7  33  [R0603]  260.73,131.95 270 bottom
R8  33  [R0603]  260.73,121.92 270 bottom
R9  33  [R0603]  258.19,131.95 270 bottom
R10  33  [R0603]  258.19,121.92 270 bottom
R11  33  [R0603]  255.65,131.95 270 bottom
R12  33  [R0603]  255.65,121.92 270 bottom
R13  33  [R0603]  253.11,131.95 270 bottom
R14  33  [R0603]  253.11,121.92 270 bottom
R15  33  [R0603]  250.57,131.95 270 bottom
R16  33  [R0603]  250.57,121.92 270 bottom
R17  33  [R0603]  248.03,131.95 270 bottom
R18  33  [R0603]  248.03,121.92 270 bottom
R19  33  [R0603]  245.49,131.95 270 bottom
R20  33  [R0603]  245.49,121.92 270 bottom
R21  27  [R0603]  150.37,188.09 270 top
R22  27  [R0603]  148.08,188.09 270 top
R23  4.7K  [R0603]  144.91,181.48 0 top
R24  470  [R0603]  144.91,178.82 0 top
R25  4.7K  [R0603]  231.01,184.4 270 top
R26  3.74  [R0603]  73.28,127.51 270 top
R27  3.74  [R0603]  75.06,127.51 270 top
R28  1K  [R0603]  77.85,126.75 180 top
R29  20K  [R0603]  103.25,152.15 270 top
R30  20K  [R0603]  109.73,153.03 270 top
R31  4.7K DNP  [R0603]  242.32,33.66 90 top
R32  4.7K  [R0603]  238.25,181.99 270 top
R33  4.7K  [R0603]  235.71,181.99 270 top
R34  0  [R0603]  128.27,175.01 180 top
R36  4.7K  [R0603]  112.52,181.74 270 top
R37  0 DNP  [R0603]  253.37,37.21 90 top
R38  6.04K 1%  [R0603]  235.2,36.07 90 top
R39  3.01K 1%  [R0603]  235.2,31.37 90 top
R40  0  [R0603]  246.63,31.62 180 top
R41  6.04K 1%  [R0603]  259.97,37.72 90 top
R42  3.01K 1%  [R0603]  258.95,33.53 90 top
R43  4.7K DNP  [R0603]  168.4,154.43 0 top
R44  4.7K DNP  [R0603]  168.4,149.35 0 top
R45  4.7K  [R0603]  178.05,149.1 180 top
R46  4.7K  [R0603]  173.1,161.54 270 top
R47  60  [R0603]  173.61,187.2 270 top
R48  60  [R0603]  175.77,187.2 270 top
R49  0  [R0603]  169.67,181.86 0 top
R50  20K  [R0603]  153.03,176.4 0 top
R51  0 DNP  [R0603]  169.8,184.15 0 top
R52  0 DNP  [R0603]  179.96,176.28 180 top
R53  0 DNP  [R0603]  159,175.64 270 top
R55  470  [R0603]  49.66,177.29 270 top
R56  0 DNP  [R0603]  8.64,49.4 90 top
R57  0  [R0603]  6.86,49.4 270 top
R58  1K  [R0603]  108.84,193.04 0 top
R59  4.7K  [R0603]  233.17,181.99 270 top
R62  10K DNP  [R0603]  157.23,175.64 270 top
R63  10K  [R0603]  117.22,166.75 0 top
R64  0.010  [RESIST_4-TERM_VISHAY]  205.1,177.16 90 top
R65  0.010  [RESIST_4-TERM_VISHAY]  28.32,44.45 180 top
R66  33  [R0603]  242.95,121.92 270 bottom
R67  0  [R0603]  142.37,79.88 90 bottom
R68  10K  [R0603]  147.45,76.33 0 bottom
R69  0 DNP  [R0603]  147.19,80.26 180 bottom
R70  0  [R0603]  207.39,157.86 0 top
R71  0  [R0603]  43.18,46.99 90 top
R72  10K  [R0603]  130.94,171.07 180 top
R73  4.7K  [R0603]  110.24,178.69 90 top
R74  4.7K  [R0603]  106.81,172.97 180 top
R75  20K  [R0603]  133.11,152.27 90 top
R76  10K  [R0603]  270.26,116.33 180 top
R77  10K  [R0603]  96.9,9.78 180 top
R78  10K  [R0603]  114.68,9.78 180 top
R79  10K  [R0603]  79.25,9.78 180 top
R80  10K  [R0603]  62.61,9.78 180 top
R81  10K  [R0603]  133.1,9.78 180 top
R82  0 DNP  [R0603]  116.33,184.53 90 top
R83  470  [R0603]  61.47,155.96 270 top
R84  0  [0805-RES]  55.88,19.94 90 top
R85  4.7K  [R0603]  64.9,166.75 270 top
R86  470  [R0603]  60.71,166.88 270 top
R87  4.7K  [R0603]  32.13,28.32 180 top
R88  470  [R0603]  23.24,28.57 0 top
R89  4.7K  [R0603]  90.93,167.77 270 top
R90  470  [R0603]  87,167.77 270 top
R91  4.7K  [R0603]  256.67,23.75 270 top
R92  470  [R0603]  252.48,23.88 270 top
R93  4.7K  [R0603]  66.67,149.48 90 top
R94  4.7K  [R0603]  73.53,149.61 90 top
R95  0  [0805-RES]  59.56,15.11 180 top
R96  0  [0805-RES]  220.22,15.11 180 top
R97  0  [0805-RES]  223.01,19.94 270 top
R98  0  [R0603]  80.64,146.05 90 top
R99  20K DNP  [R0603]  4.57,38.86 0 top
S1  Power  [EVQ-PAC04M]  208.41,5.08 0 top
S2  Reset  [EVQ-PAC04M]  268.61,111.76 0 top
S3  Up  [EVQ-PAC04M]  93.98,5.08 0 top
S4  Down  [EVQ-PAC04M]  111.76,5.08 0 top
S5  Right  [EVQ-PAC04M]  76.2,5.08 0 top
S6  Left  [EVQ-PAC04M]  59.69,5.08 0 top
S7  Enter  [EVQ-PAC04M]  130.18,5.08 0 top
U1  74HC237  [TSSOP16]  112.9,132.46 0 top
U2  CAT4139T  [TSOT-23-5]  80.26,129.54 270 top
U3  NCV7342  [SOIC08]  174.5,179.58 0 top
U4  SN74LVC2G126  [SM8-TI-A]  94.61,146.05 180 top
U5  FT231XS  [SSOP20-.150]  153.92,182.63 90 top
U6  SN74LVC2G126A  [SM8-TI-A]  102.23,146.05 180 top
U7  SN74LVC2G126A  [SM8-TI-A]  110.11,146.18 180 top
U8  SN74LVC2G126A  [SM8-TI-A]  117.73,146.18 180 top
U9  SN74LVC2G126A  [SM8-TI-A]  125.22,146.18 180 top
U10  SN74LVC2G126A  [SM8-TI-A]  132.72,146.05 180 top
U11  SC16IS740IPW  [TSSOP16]  121.67,180.85 180 top
U12  CAT24C256WI-GT3  [SO08]  173.74,155.19 0 top
U13  SN74LVC2G126  [SM8-TI-A]  251.97,31.37 90 top
U14  ADG4612  [TSSOP16]  262.89,160.4 270 top
U15  ADG4612  [TSSOP16]  247.78,160.4 270 top
U17  IL712S  [SOIC08]  49.4,44.07 180 top
U18  INA225  [MSOP8]  205.49,161.04 270 top
U19  INA225  [MSOP8]  40.51,43.05 0 top
U20  TPS22958  [MSOP8-POWERPAD]  12.57,43.43 270 top
U21  SN74LVC2G126  [SM8-TI-A]  74.55,165.23 180 top
U22  SN74LVC2G126  [SM8-TI-A]  41.4,30.1 180 top
U23  SN74LVC2G126  [SM8-TI-A]  97.16,165.99 180 top
U24  SN74LVC2G126  [SM8-TI-A]  262,22.61 180 top
U25  SN74LVC2G126  [SM8-TI-A]  83.31,152.02 180 top
U$3  [HERMES]  153.03,5.21 0 top
U$62  [RFMLOGO3B]  26.04,11.3 0 top
U$80  [SERNUM]  263.65,6.6 180 top

## Tracks (layer width: path | path; a pad name or v marks a point on that pad's centre or on a via)
!CTS  (via drill 0.6)
  Top 0.254: U5.9 159.64,184.85 v160.02,184.78
  SI1 0.254: v160.02,184.78 94.74,184.78 94.74,179.71 92.58,179.71 J15.3
!DTR  (via drill 0.6)
  Top 0.254: U5.1 158.75,179.77 v159.26,178.94
  SI1 0.254: v159.26,178.94 v96.14,178.94
  SI2 0.254: v96.14,178.94 96.14,182.12 J15.5
!IRQ  (via drill 0.6)
  Top 0.254: U11.7 120.02,183.7 120.02,187.96 | 120.02,187.96 J37A.4 | R82.1 116.46,182.62 116.6,182.5 117.86,182.5 117.86,187.96 120.02,187.96 | R58.2 v111.38,193.04
  SI1 0.254: v111.38,193.04 118.75,193.04 J37A.4
  SI2 0.254: J37.4 J37A.4
!LCD_BACKLIGHT  (via drill 0.6)
  Top 0.254: U2.4 82.62,128.59 82.68,128.52 v82.68,127
  SI1 0.254: v82.68,127 82.68,121.67 71.5,121.67 71.5,92.01 65.66,92 65.66,78.36 102.23,78.36 105.28,88.77 v229.36,88.77
  SI2 0.254: MD1.~14 228.98,172.85 228.98,109.35 227.46,107.57 227.46,99.31 229.36,97.92 v229.36,88.77
!RTS  (via drill 0.6)
  Top 0.254: U5.2 159.38,180.4 v160.91,179.07
  SI1 0.254: v160.91,179.07 160.91,177.93 103.38,177.93 101.09,177.04 J15.1
+5V
  Top 0.254: J11.1 262.38,189.61 | 272.55,191.01 F2.1 272.17,190.89
  Top 3.81: 262.38,189.61 267.46,190.37 272.55,191.01
A0/CS  (via drill 0.6)
  Top 0.254: U11.2 123.24,185.32 123.28,185.33 125.09,185.33 125.09,185.67 v126.36,185.67
  SI1 0.254: v126.36,162.56 J28.1
  SI2 0.254: J37.5 J37A.5 123.95,188.72 126.36,188.72 v126.36,185.67 126.36,167.26 J35.3 v126.36,162.56
A1/SI  (via drill 0.6)
  Top 0.254: U11.3 122.59,186.03 122.68,186.18 v123.83,186.31 125.09,186.56 J37A.6
  SI1 0.254: v123.83,161.29 143.13,161.29 J28.3
  SI2 0.254: J37A.6 J37.6 | v123.83,186.31 123.83,168.66 | v123.83,161.29 123.83,168.66 | J35.4 123.83,168.66
AIN0
  Top 0.254: U14.7 262,158.73 262,175.13 MD1.~39
AIN1
  Top 0.254: MD1.~40 260.73,169.29 256.03,169.29 256.03,165.74 256.03,158.62 254.98,157.99 252.58,158.72 U15.10
AIN2  (via drill 0.6)
  Top 0.254: v272.42,159.26 271.91,158.75 267.36,158.75 U14.10
  SI1 0.254: v272.42,159.26 273.94,160.27 273.94,165.74 273.94,179.45 258.19,179.45 MD1.~37
AIN3
  Top 0.254: MD1.~38 258.19,169.93 253.37,169.93 253.37,161.98 U15.15
AIN4  (via drill 0.6)
  Top 0.254: v257.81,166.75 257.81,162.05 258.1,161.98 U14.2
  SI1 0.254: MD1.~33 254.38,175.13 254.38,166.75 v257.81,166.75
AIN4_SW  (via drill 0.6)
  Top 0.254: U14.3 256.92,161.33 v256.92,168.15
  SI1 0.254: v256.92,168.15 256.92,183.01 256.41,183.77 256.41,188.85 255.02,190.25 v231.52,190.25
  SI2 0.254: v231.52,190.25 J32.7
AIN5
  Top 0.254: MD1.~36 255.65,171.96 252.73,171.96 252.73,165.86 242.82,165.86 242.83,161.98 U15.2
AIN5_SW  (via drill 0.6)
  Top 0.254: U15.3 242.19,161.33 242.19,166.62 246.76,166.62 246.76,179.2 v240.54,179.2 | v240.54,189.1 234.06,189.1 J32.9
  SI2 0.254: v240.54,179.2 v240.54,189.1
AIN6
  Top 0.254: MD1.~35 255.65,178.05 270.13,178.05 270.13,169.29 269.11,169.29 269.11,161.98 U14.15
BBB_I-SENSE
  Top 0.254: R70.2 210.19,157.86 | U15.14 248.03,161.29 248.03,156.72 240.03,156.72 240.03,159.77 214.76,159.77 214.76,157.1 211.71,157.1 211.71,157.86 210.19,157.86 | 210.19,157.86 C26.1
BBB_I-SENSE+
  Top 0.254: R64.4 199.8,177.55 197.52,177.55 197.52,163.96 205.36,163.96 205.36,162.01 U18.1
BBB_I-SENSE-
  Top 0.254: R64.3 199.78,172.64 199.78,177.05 198.12,177.04 198.12,164.59 205.99,164.59 206.02,162.01 U18.8
BRIDGE_CLK
  Top 0.254: U11.15 123.24,177.11 123.24,176.02 125.09,176.02 | R34.2 125.09,175.01 125.09,176.02 | 125.09,176.02 125.09,176.78 C12.1
BRIDGE_RX  (via drill 0.6)
  Top 0.254: U7.3 109.78,150.78 109.73,150.85 R30.2 109.73,150.88 v108.2,150.88 | U23.2 97.48,170.05 103.76,170.05 103.76,168.91 v108.2,168.91 118.62,168.91 121.28,172.97 121.92,175.39 121.94,175.41 U11.13
  SI2 0.254: v108.2,168.91 v108.2,150.88
BRIDGE_SEL  (via drill 0.6)
  Top 0.254: U1.12 113.28,139.95 111.25,139.95 111.12,141.73 110.49,142.49 110.43,142.55 U7.7 110.43,145.78 111.08,146.54 U7.1 111.09,146.59 110.8,146.19 108.55,146.19 v107.7,145.16 | v93.34,165.86 97.79,165.86 98.13,166.16 U23.1 98.13,166.17 98.11,166.17 97.48,165.53 U23.7
  SI2 0.254: v107.7,145.16 93.34,145.16 v93.34,165.86
BRIDGE_TX  (via drill 0.6)
  Top 0.254: U23.5 96.14,164.09 96.14,162.43 v94.87,161.93 | v120.52,175.01 121.28,176.28 121.29,176.28 U11.12 | v111.51,151.26 110.43,149.48 U7.2
  SI1 0.254: v94.87,161.93 95.12,161.54 v111.51,161.54 v120.52,161.54
  SI2 0.254: v120.52,161.54 v120.52,175.01 | v111.51,161.54 v111.51,151.26
CANH
  Top 0.254: U3.7 173.86,184.94 173.61,184.91 | R47.2 173.61,184.91 | 173.61,184.91 172.46,184.91 172.47,185.03 172.47,189.61 172.85,189.61 J34A.1
  SI2 0.254: J34A.1 J34.1
CANL  (via drill 0.6)
  Top 0.254: U3.6 175.13,184.66 175.77,185.17 R48.2 175.77,185.29 178.06,185.29 v178.44,185.92
  SI2 0.254: J34.2 J34A.2 175.39,189.87 178.44,189.87 v178.44,185.92
DCAN1_RX  (via drill 0.6)
  Top 0.254: 176.4,177.16 U3.4 176.4,174.72 177.8,174.72 | R52.2 177.8,176.28 177.8,174.72 | 177.8,174.72 177.8,170.42 179.71,170.43 179.71,167.51 v184.53,167.51
  SI1 0.254: v184.53,167.51 185.93,166.88 239.14,166.88 239.14,172.59 MD1.~24
DCAN1_TX  (via drill 0.6)
  Top 0.254: U3.1 172.59,167.89 175.9,167.89 175.9,164.21 184.4,164.21 v184.4,165.74
  SI1 0.254: MD1.~26 241.68,172.59 241.55,165.74 v184.4,165.74
DOWN_BUT  (via drill 0.6)
  Top 0.254: 115.7,9.78 R78.1 117.47,9.78 117.47,7.37 115.57,7.37 S4.2
  SI1 0.254: v244.22,56.52 107.7,56.52 107.7,68.2 65.79,68.2 65.79,12.83 71.25,12.83 71.25,11.05 107.95,11.05 S4.1 S4.2
  SI2 0.254: v244.22,56.52 244.22,142.24 246.76,142.24 246.76,175.01 MD1.~27
EEPROM-WP
  Top 0.254: R46.2 U12.7 173.1,155.45 156.84,155.45 J28.13
ENTER_BUT
  Top 0.254: R81.1 135.89,9.78 135.89,7.37 133.99,7.37 S7.2
  SI2 0.254: MD1.18 232.66,125.48 232.66,110.36 234.57,108.84 234.57,100.58 232.79,99.06 232.79,5.59 180.97,5.46 180.97,10.54 137.03,10.54 137.03,7.37 133.99,7.37 | 133.99,7.37 S7.2 | 133.99,7.37 126.36,7.37 S7.1
EXT_UART_RX  (via drill 0.6)
  Top 0.254: U6.2 102.55,149.93 102.59,149.97 103.25,149.99 | 103.25,149.99 103.25,149.98 104.52,149.98 v104.52,154.31 | 103.37,151.38 R29.2 103.25,149.99
  SI1 0.254: v154.31,154.31 v104.52,154.31 v101.22,154.31
  SI2 0.254: J20.4 J20A.4 96.01,188.21 101.22,188.21 v101.22,154.31 | v154.31,154.31 J28.11
EXT_UART_TX  (via drill 0.6)
  Top 0.254: U6.3 101.91,153.23 102.25,153.92 v102.23,155.55
  SI1 0.254: v151.76,155.57 v102.23,155.55
  SI2 0.254: J20.5 J20A.5 102.23,190.5 102.23,157.86 v102.23,155.55 | v151.76,155.57 J28.9
GND  (via drill 0.6, 1.1)
  Top 0.254: C1.2 146.18,190.75 146.18,191.77 147.94,191.77 148.13,191.96 J12.5 | C30.2 v162.31,192.15 160.66,191.77 | C3.2 160.66,191.77 | 160.66,190.13 C31.2 160.66,191.77 | U5.6 158.89,182.94 159.73,183.39 160.43,183.6 v163.45,184.4 163.44,184.28 C15.2 | U5.16 148.17,182.31 v148.08,182.25 | C9.1 120.52,147.19 v121.03,147.7 | C10.1 v128.14,147.57 | C11.1 v135.64,147.19 | v130.3,149.73 131.74,149.47 U10.4 | v121.79,149.99 124.26,149.43 124.25,147.96 U9.4 | v114.55,149.61 116.75,149.61 116.75,147.96 U8.4 | v113.03,147.32 C8.1 113.03,145.67 | v105.16,147.07 C7.1 | v106.81,149.86 107.7,149.86 109.14,149.38 109.13,147.96 U7.4 | v99.82,149.61 101.26,149.61 U6.4 | v95,151.38 93.64,150.7 U4.4 | v97.66,146.94 C4.1 | 115.24,127.62 115.24,129.6 U1.8 115.23,127.64 | 115.23,127.64 115.82,127.64 v117.6,128.02 | U1.4 112.64,127.64 113.28,127.64 | 113.28,127.64 U1.5 | U1.5 | 113.28,127.64 115.24,127.62 | 115.24,127.62 115.23,127.64 | C37.2 v108.08,130.3 | C14.2 180.21,189.1 180.21,190.75 177.93,190.75 J34A.3 | 259.97,31.62 260.99,31.62 C22.2 | C23.2 236.98,29.21 235.2,29.21 | R39.1 235.2,29.21 | 235.2,29.21 v235.2,28.07 | U13.4 255.27,32.34 v255.27,33.53 | C42.2 v254.25,28.83 | R42.1 258.95,31.62 259.97,31.62 | R26.1 73.28,129.54 | v40.26,36.58 40.25,37.97 | C25.1 40.25,37.97 | 40.25,37.97 40.19,38.1 U19.2 | C27.2 v37.72,49.28 37.72,47.12 40.13,47.12 | C44.1 v48.51,27.3 | C41.2 53.98,43.18 v58.17,43.18 | v38.99,33.78 40.43,33.78 U22.4 | D6.C v61.47,146.43 | C47.1 v86.74,153.92 | U25.4 82.35,155.56 v80.77,156.21 | U21.4 73.6,168.92 71.12,168.91 v71.12,167 | C43.1 v77.72,166.88 | U23.4 96.19,169.39 v95,171.2 | C45.1 v100.33,167.26 | C46.1 v264.92,24.64
  Top 0.254: v259.84,26.92 261.03,26.42 U24.4 | 203.24,161.42 U18.2 201.68,161.36 201.68,162.43 200.66,162.43 | C26.2 210.19,162.05 | 210.19,162.05 213.23,162.05 v213.23,158.37 | v198.25,160.15 198.63,162.43 200.66,162.43 | C32.2 v254.63,165.35 | v270.89,166.12 C35.2 | 258.44,160.27 258.44,160.02 258.83,160.02 U14.5 | U15.4 243.59,160.66 243.59,160.4 v242.19,160.02 243.59,160.41 243.59,160.03 243.59,160.02 U15.5 | v257.18,160.27 258.44,160.27 | 258.44,160.27 258.44,160.66 258.7,160.66 U14.4 | U3.2 173.86,169.54 v173.99,169.42 175.13,169.42 C33.2 | v168.78,179.2 168.77,180.34 R49.1 | v178.82,179.32 C34.2 | U11.9 119.34,176.02 J36.3 115.32,178.18 112.51,178.18 R36.2 | C36.2 128.52,188.21 127.65,188.21 127.64,188.22 J37A.7 | v170.69,167.77 C13.2 | 200.66,162.43 C24.1 | U17.5 47.5,38.35 v46.48,38.35 | C49.2 19.56,43.69 19.56,42.8 16.13,42.8 15.66,43.08 15.37,43.1 U20.6 12.57,43.11 U20.10 | U12.4 175.64,150.8 175.69,150.75 178.05,150.75 J25.1 | C2.2 v154.56,190.63 | U18.7 208.91,161.36 | 210.19,162.05 208.91,162.05 208.91,161.36 | U18.6 208.91,160.71 | 208.91,160.71 208.91,161.36 | U18.5 208.91,160.06 208.91,160.71 | v130.81,176.78 129.16,176.78 | U19.7 40.2,47.11 40.13,47.12 | U19.6 40.83,47.11 40.78,47.12 | 40.78,47.12 40.13,47.12 | U19.5 41.49,47.11 41.49,47.12 40.78,47.12 | v2.54,41.27 2.54,38.86 3.68,38.86 | 259.97,31.62 v259.97,30.35 | R55.2 49.66,175.01 54.99,175.01 54.99,177.29 55.04,177.29 MD3.10 | R93.2 66.67,155.83 v69.98,155.83 73.53,155.83 R94.2
  Top 0.305: C5.2 84.7,128.89
  Top 0.406: C29.2 255.65,192.16 | v84.71,128.4 83.95,128.91 83.06,129.54 U2.2 77.72,129.56 | 71.77,129.41 C6.2 | R26.1 73.28,129.53 | 75.06,129.54 R27.1 | C19.2 16.51,37.97 | 9.4,37.97 C18.2 | MD1.~1 212.47,178.05 211.84,178.05 211.84,178.18 211.82,179.71 C39.2 | C48.2 v215.52,170.43 C40.2 | v49.78,189.36 49.78,190.75 | 49.78,190.75 48.9,190.75 C17.2 | C16.2 50.67,190.75 49.78,190.75
  Top 0.508: v12.57,37.97 v12.57,41.02 12.58,37.97 | 16.51,37.97 12.58,37.97 | 12.58,37.97 v12.57,37.97 | v12.57,37.97 9.4,37.97
  Top 0.61: 255.65,192.16 J11.3 | C28.C 252.35,192.28 | 84.7,128.89 84.71,128.38 v84.71,128.4 | 77.72,129.56 77.72,129.54 75.06,129.54 73.28,129.54 73.28,129.53 71.77,129.41 v71.75,129.41
  Top 1.27: D4.A 248.03,194.28 256.09,194.28 J11.3 252.35,192.28 | MD1.~1 MD1.~2 | MD1.~45 MD1.~43 MD1.~44 MD1.~46 MD1.~45
  Top 2.54: J11.3 262.21,195.12 J11.2
  SI1 1.27: MD1.~1 MD1.~2 | MD1.~45 MD1.~43 MD1.~44 MD1.~46 MD1.~45
  GND 2.54: v22.73,177.04 22.73,198.25
  PWR 1.27: MD1.~2 MD1.~1 | MD1.~45 MD1.~46 MD1.~44 MD1.~43 MD1.~45
  SI2 0.254: J37.7 J37A.7 | J34A.3 177.93,198.75 | J20A.1 J20.1
  SI2 1.27: MD1.~1 MD1.~2 | MD1.~43 MD1.~44 MD1.~46 MD1.~45 MD1.~43
  Bottom 0.203: v84.58,80.52 84.63,80.57 84.63,80.58 MD2.14 | 79.12,84.07 79.12,84.58 79.63,84.58 80.14,84.58 80.14,83.82
  Bottom 0.254: MD2.14 84.64,83.04 84.64,84.56 84.14,84.56 MD2.13 | v89.15,80.52 MD2.23 89.15,83.01 89.15,84.84 88.63,84.84 | MD2.22 88.63,84.84 | 88.63,84.84 88.14,84.84 88.14,83.01 MD2.21 | MD2.36 v95.63,80.52 MD2.42 | v92.2,80.52 92.19,80.53 92.11,80.64 MD2.29 | MD2.7 81.13,84.58 80.62,84.58 80.64,83.01 MD2.6 80.63,84.58 80.14,84.58 MD2.5 | MD2.5 80.12,80.52 v81.41,80.52 MD2.41 72.39,80.52 72.39,79.12 71.25,79.12 C20.2 | MD2.3 79.12,84.07 | 80.14,83.82 MD2.5 | MD2.~7 131.82,72.39 v131.44,72.39 | MD2.~2 138.97,78.26 v137.92,78.99 | MD2.~8 151.64,72.39 v151.64,74.17 | E4.1 22.73,198.12 | 79.63,84.58 v79.63,88.52
  Bottom 1.27: MD1.~2 MD1.~1 | MD1.~43 MD1.~44 MD1.~46 MD1.~45 MD1.~43
  Bottom 2.54: 22.73,198.12 v22.73,177.04
  other vias: 76.71,129.54 12.57,45.97 7.75,77.6 10.29,77.6 12.83,77.6 15.37,77.6 17.91,77.6 21.72,77.6 24.26,77.6 26.8,77.6 29.34,77.6 31.88,77.6 34.42,77.6 7.75,80.14 10.29,80.14 12.83,80.14 15.37,80.14 17.91,80.14 21.72,80.14 24.26,80.14 26.8,80.14 29.34,80.14 31.88,80.14 34.42,80.14 7.75,82.68 10.29,82.68 12.83,82.68 15.37,82.68 17.91,82.68 21.72,82.68 24.26,82.68 26.8,82.68 29.34,82.68 31.88,82.68 34.42,82.68 7.75,85.22 10.29,85.22 12.83,85.22 15.37,85.22 17.91,85.22 21.72,85.22 24.26,85.22 26.8,85.22 29.34,85.22 31.88,85.22 34.42,85.22 7.75,87.76 10.29,87.76 12.83,87.76 15.37,87.76 17.91,87.76 21.72,87.76 24.26,87.76 26.8,87.76 29.34,87.76 31.88,87.76 34.42,87.76 7.75,90.3 10.29,90.3 12.83,90.3 15.37,90.3 17.91,90.3 21.72,90.3 24.26,90.3 26.8,90.3 29.34,90.3 31.88,90.3 34.42,90.3 7.75,92.84 10.29,92.84 12.83,92.84 15.37,92.84 17.91,92.84 21.72,92.84 24.26,92.84 26.8,92.84 29.34,92.84 31.88,92.84 34.42,92.84 7.75,95.38 10.29,95.38 12.83,95.38 15.37,95.38 17.91,95.38 21.72,95.38 24.26,95.38 26.8,95.38 29.34,95.38 31.88,95.38 34.42,95.38 7.75,97.92 10.29,97.92 12.83,97.92 15.37,97.92 17.91,97.92 21.72,97.92 24.26,97.92 26.8,97.92 29.34,97.92 31.88,97.92 34.42,97.92 7.75,100.46 10.29,100.46 12.83,100.46 15.37,100.46 17.91,100.46 21.72,100.46 24.26,100.46 26.8,100.46 29.34,100.46 31.88,100.46 34.42,100.46 7.75,103 10.29,103 12.83,103 15.37,103 17.91,103 21.72,103 24.26,103 26.8,103 29.34,103 31.88,103 34.42,103 7.75,105.54 10.29,105.54 12.83,105.54 15.37,105.54 17.91,105.54 21.72,105.54 24.26,105.54 26.8,105.54 29.34,105.54 31.88,105.54 34.42,105.54 15.37,108.08 17.91,108.08 21.72,108.08 24.26,108.08 26.8,108.08 29.34,108.08 31.88,108.08 34.42,108.08 15.37,110.62 17.91,110.62 21.72,110.62 24.26,110.62 26.8,110.62 29.34,110.62 31.88,110.62 34.42,110.62 15.37,113.16 17.91,113.16 21.72,113.16 24.26,113.16 26.8,113.16 29.34,113.16 31.88,113.16 34.42,113.16 7.75,115.7 10.29,115.7 12.83,115.7 15.37,115.7 17.91,115.7 21.72,115.7 24.26,115.7 26.8,115.7 29.34,115.7 31.88,115.7 34.42,115.7 7.75,118.24 10.29,118.24 12.83,118.24 15.37,118.24 17.91,118.24 21.72,118.24 24.26,118.24 26.8,118.24 29.34,118.24 31.88,118.24 34.42,118.24 7.75,120.78 10.29,120.78 12.83,120.78 15.37,120.78 17.91,120.78 21.72,120.78 24.26,120.78 26.8,120.78 29.34,120.78 31.88,120.78 34.42,120.78 7.75,123.32 10.29,123.32 12.83,123.32 15.37,123.32 17.91,123.32 21.72,123.32 24.26,123.32 26.8,123.32 29.34,123.32 31.88,123.32 34.42,123.32 7.75,125.86 10.29,125.86 12.83,125.86 15.37,125.86 17.91,125.86 21.72,125.86 24.26,125.86 26.8,125.86 29.34,125.86 31.88,125.86 34.42,125.86 7.75,128.4 10.29,128.4 12.83,128.4 15.37,128.4 17.91,128.4 21.72,128.4 24.26,128.4 26.8,128.4 29.34,128.4 31.88,128.4 34.42,128.4 7.75,130.94 10.29,130.94 12.83,130.94 15.37,130.94 17.91,130.94 21.72,130.94 24.26,130.94 26.8,130.94 29.34,130.94 31.88,130.94 34.42,130.94 7.75,133.48 10.29,133.48 12.83,133.48 15.37,133.48 17.91,133.48 21.72,133.48 24.26,133.48 26.8,133.48 29.34,133.48 31.88,133.48 34.42,133.48 7.75,136.02 10.29,136.02 12.83,136.02 15.37,136.02 17.91,136.02 21.72,136.02 24.26,136.02 26.8,136.02 29.34,136.02 31.88,136.02 34.42,136.02 7.75,138.56 10.29,138.56 12.83,138.56 15.37,138.56 17.91,138.56 21.72,138.56 24.26,138.56 26.8,138.56 29.34,138.56 31.88,138.56 34.42,138.56 7.75,141.1 10.29,141.1 12.83,141.1 15.37,141.1 17.91,141.1 21.72,141.1 24.26,141.1 26.8,141.1 29.34,141.1 31.88,141.1 34.42,141.1 7.75,143.64 10.29,143.64 12.83,143.64 15.37,143.64 17.91,143.64 21.72,143.64 31.88,143.64 34.42,143.64 3.94,175.39 3.94,171.58 3.94,160.15 40.77,174.12 5.21,19.18 17.91,5.21 36.96,5.21 251.59,5.21 273.18,62.36 273.18,94.11 12.57,48.13 12.57,50.04 12.57,36.58
  pour GND (isolate 0.305): 1.27,1.4 1.27,178.56 48.39,178.56 48.13,196.34 86.74,196.34 86.87,196.22 86.87,196.34 88.27,196.34 140.97,196.6 140.84,201.93 141.1,202.06 278,201.93 278.13,1.27
  pour Bottom (isolate 0.254): 1.27,1.27 1.4,177.93 1.4,178.44 48.39,178.56 48.39,178.94 48.26,196.34 141.1,196.47 140.97,202.06 278.13,201.93 278.13,1.27
  pour Top (isolate 0.61, rank 2): 1.27,1.27 1.27,178.44 48.51,178.44 48.26,196.22 140.97,196.6 140.84,202.06 278.13,201.93 278.13,1.27
  cutout Top: 72.39,12.06 177.16,12.06 177.16,43.81 102.23,43.81 102.23,64.14 72.39,64.14
  cutout Bottom: 72.39,12.06 177.16,12.06 177.16,43.81 102.23,43.81 102.23,64.14 72.39,64.14
  cutout GND: 72.39,12.06 177.16,12.06 177.16,43.81 102.23,43.81 102.23,64.14 72.39,64.14
GND_RF  (6 unrouted)
  Top 0.254: J17.3 40.39,200.91 40.39,197.99
  Top 0.61: J13.2 J13.3
GPIO0_7  (via drill 0.6)
  Top 0.254: v6.86,54.99 R57.1
  SI1 0.254: v6.86,54.99 57.91,54.99 57.91,76.07 115.19,76.07 115.19,65.66 v270.64,65.66
  SI2 0.254: J32.21 249.3,179.2 262,179.2 262,175.13 MD1.~42 266.06,171.45 266.06,153.42 270.64,153.42 v270.64,65.66
GPIO0_20
  SI2 0.254: J32.23 251.84,179.96 263.27,179.96 MD1.~41
GPIO0_23
  Top 0.254: J29.2 168.91,141.6 | 168.91,141.6 227.08,141.6 227.71,140.84 MD1.13 | 168.91,141.6 150.62,141.6 150.37,141.99 150.37,157.1 149.73,157.73 135.25,157.73 134.62,158.37 134.62,174.5 134.11,175.01 R34.1
GPIO1_12  (via drill 0.6)
  Top 0.254: R52.1 v187.96,176.28
  SI1 0.254: J32.14 239.14,201.8 v187.96,201.8 | v187.96,155.07 v223.9,155.07
  SI2 0.254: v187.96,201.8 v187.96,176.28 v187.96,155.07 | v223.9,155.07 223.9,127 MD1.12
GPIO1_13  (via drill 0.6)
  Top 0.254: R51.1 168.02,184.15 168.02,186.06 169.04,186.06 v169.04,187.32 | v116.33,187.32 R82.2
  SI1 0.254: v116.33,187.32 v169.04,187.32 182.25,187.32 182.25,191.52 v196.09,191.52 v235.33,191.52 | v196.09,151.51 v225.17,151.51
  SI2 0.254: J32.12 235.33,199.01 v235.33,191.52 | v196.09,191.52 v196.09,151.51 | v225.17,151.51 MD1.11
GPIO1_14  (via drill 0.6)
  Top 0.254: R37.2 v253.37,39.88 | J32.19 248.03,199.01 255.52,199.01 v256.54,200.41 | v80.64,143.51 R98.1
  SI1 0.254: v230.25,99.06 v252.6,99.06 v277.37,99.06 | v252.6,85.6 v107.44,85.6
  SI2 0.254: v252.6,99.06 v252.6,85.6 252.6,39.88 v253.37,39.88 | v230.25,99.06 228.22,100.71 228.22,106.55 230.25,109.09 MD1.16 | v256.54,200.41 269.88,200.41 269.88,193.55 278.13,193.55 278.26,100.58 v277.37,99.06 | v107.44,85.6 107.44,117.22 88.65,117.22 88.65,142.49 81.92,142.49 v80.64,143.51
GPIO1_15  (via drill 0.6)
  Top 0.254: R40.2 244.73,31.62 244.73,34.67 v247.52,34.67
  SI1 0.254: v226.44,101.35 v247.52,101.35 v276.86,101.35 | v226.44,122.94 226.44,126.87 228.98,126.87 MD1.15 | J32.17 245.49,199.01 255.4,199.01 v256.67,198.5
  SI2 0.254: v247.52,34.67 v247.52,101.35 | v226.44,101.35 v226.44,122.94 | v256.67,198.5 257.43,198.88 268.61,198.88 268.61,192.28 277.24,192.28 277.24,103.12 v276.86,101.35
GPIO2_3  (via drill 0.6)
  Top 0.254: v160.66,173.35 159,173.1 R53.2
  SI1 0.254: v232.79,188.98 v193.68,188.98 | v194.06,173.35 v160.66,173.35 | v193.68,150.37 v218.82,150.37
  SI2 0.254: J32.8 232.79,199.01 v232.79,188.98 | v193.68,188.98 193.68,175.01 v194.06,173.35 193.68,171.58 v193.68,150.37 | v218.82,150.37 218.82,126.87 MD1.8
GPIO2_5  (via drill 0.6)
  SI1 0.254: v236.6,131.44 222.63,131.44 MD1.9 | v236.6,83.19 v144.65,83.19 | v223.9,158.12 v236.6,158.12
  SI2 0.254: J32.10 232.79,201.68 225.17,201.68 225.17,193.29 223.9,192.66 v223.9,158.12 | v236.6,83.19 v236.6,131.44 v236.6,158.12
  Bottom 0.254: v144.65,83.19 145.41,82.42 149.35,82.42 149.35,80.26 R69.2
I2C1_SCL  (via drill 0.6)
  Top 0.254: R59.2 233.17,178.44 MD1.~17 234.06,175.13 239.14,175.13 239.14,177.67 239.52,178.05 239.52,180.34 241.68,182.25 241.68,194.77 242.95,194.77 242.95,199.01 J32.16
  SI1 0.254: MD1.~17 234.06,175.13 234.06,167.77 186.94,167.77 v184.66,169.29
  SI2 0.254: v184.66,169.29 184.66,184.66 J41.2
I2C1_SDA  (via drill 0.6)
  Top 0.254: v231.01,181.61 R25.2 231.02,178.42 231.52,178.05 231.52,175.13 MD1.~18
  SI1 0.254: v242.95,181.61 v231.01,181.61 | v191.64,168.66 231.52,168.66 231.52,172.59 MD1.~18
  SI2 0.254: J32.18 242.95,199.01 v242.95,181.61 | v191.64,168.66 191.64,184.66 J41.4
I2C2-SCL  (via drill 0.6)
  Top 0.254: v164.72,166.75 166.88,168.91 171.83,168.91 171.96,168.78 171.96,166.75 174.37,166.75 U12.6 | R33.2 235.71,178.56 MD1.~19 | v228.6,190.12 202.56,190.12 J30.4
  SI1 0.254: J30.4 202.56,197.1 v164.72,197.1 | v139.32,169.24 164.72,169.24 v164.72,166.75
  SI2 0.254: v164.72,197.1 v164.72,166.75 | v139.32,83.62 v139.32,169.24 | MD1.~19 234.19,178.82 228.6,178.82 v228.6,190.12
  Bottom 0.254: MD2.~3 139.95,80.26 139.32,80.9 v139.32,83.62
I2C2-SDA  (via drill 0.6)
  Top 0.254: v238.25,179.2 R32.2 | v175.64,160.15 U12.5
  SI1 0.254: MD1.~20 236.6,175.13 236.6,179.2 | v210.19,192.79 206.12,192.79 206.12,193.55 168.66,193.55 v167.13,192.53 | v140.97,160.15 v167.13,160.15 v175.64,160.15 | v210.19,183.51 211.2,183.51 211.2,179.2 236.6,179.2 | 236.6,179.2 v238.25,179.2
  SI2 0.254: v210.19,192.79 J30.7 v210.19,183.51 | v167.13,192.53 v167.13,160.15 | v140.97,83.57 v140.97,160.15
  Bottom 0.254: MD2.~4 140.97,80.89 v140.97,83.57
I2C/!SPI  (via drill 0.6)
  Top 0.254: U11.8 119.36,185.17 119.33,185.2 v119,186.06 | R36.1 112.53,185.17 v111.51,186.06
  SI1 0.254: v119,186.06 v111.51,186.06
  SI2 0.254: v111.51,186.06 111.51,172.97 114.81,172.97 114.81,164.85 J10.2
KNX_3.3V
  Top 0.254: R38.2 235.2,41.91 MD6.23 229.49,42.8 229.49,18.03 J22.1 J22.2 J22.3 243.97,18.03 243.97,29.34 242.32,29.34 R31.1
  SI1 0.254: J21.8 267.46,41.15 237.36,41.15 MD6.23
KNX_3.3V_DIV  (via drill 0.6)
  Top 0.254: 235.2,33.66 R38.1 | 235.19,32.26 R39.2 235.2,33.66 | 235.2,33.66 236.98,33.66 C23.1 | U15.11 252.73,159.38 v253.62,159.51 | v233.93,33.66 235.2,33.66
  SI1 0.254: v253.62,159.51 254.38,156.72 v274.45,156.72 | v275.46,50.67 233.93,50.67 v233.93,33.66
  SI2 0.254: v274.45,156.72 275.46,156.72 275.46,105.03 274.7,103.38 274.7,97.66 275.46,96.65 v275.46,50.67
KNX_ANAOUT
  Top 0.254: MD6.5 258.95,39.75 259.97,39.75 | J21.3 267.46,26.8 267.46,39.75 259.97,39.75 | 259.97,39.75 R41.2
KNX_ANAOUT_DIV  (via drill 0.6)
  Top 0.254: R41.1 259.97,35.56 | R42.2 258.95,35.56 259.97,35.56 | 259.97,35.56 260.99,35.56 C22.1 261,35.56 262.76,35.56 v262.76,33.02 | U14.6 258.45,159.38 258.44,159.38 v257.18,157.99
  SI1 0.254: v257.18,157.99 v275.34,157.99 | v262.76,33.02 v276.48,33.02
  SI2 0.254: v275.34,157.99 276.35,157.99 276.35,104.01 275.72,102.87 275.72,98.17 276.48,97.28 v276.48,33.02
KNX_CSB
  SI2 0.254: J23.2 240.41,21.84 240.41,27.18 239.65,27.18 239.65,40.39 242.44,40.39 242.44,44.07 MD6.18
KNX_RESETB
  SI2 0.254: J21.5 271.02,31.75 271.02,40.64 261.37,40.64 260.22,41.78 260.22,44.07 257.81,44.07 MD6.8
KNX_RX  (via drill 0.6)
  Top 0.254: U24.2 262.33,28.19 264.01,28.18 265.2,28.19 v265.18,35.81 | v116.33,151.13 117.17,150.37 117.4,150.16 U8.3 | R31.2 242.32,35.81 v246.25,35.81
  SI1 0.254: v265.18,35.81 v246.25,35.81 | v135.51,80.14 v245.24,80.14
  SI2 0.254: v246.25,35.81 MD6.15 244.98,44.07 244.98,49.91 245.24,49.91 v245.24,80.14 | v116.33,151.13 116.33,127.38 116.36,80.71 116.59,80.14 v135.51,80.14
KNX_SAVEB  (via drill 0.6)
  Top 0.254: U13.2 254,31.04 255.87,31.05 256.6,31.05 v257.18,30.48
  SI2 0.254: J21.4 263.91,29.21 263.91,38.99 256.41,38.99 | 256.41,38.99 MD6.7 | v257.18,30.48 256.41,31.24 256.41,38.99
KNX_SCK
  Top 0.254: J23.3 243.08,20.57 243.08,28.32 240.66,28.32 240.66,39.37 244.98,39.37 244.98,44.07 247.4,44.07 MD6.14
KNX_SEL  (via drill 0.6)
  Top 0.254: U8.1 118.7,146.53 118.69,146.52 118.4,146.26 118.05,145.95 U8.7 118.05,143.03 118.05,142.65 118.11,142.49 118.75,141.73 118.75,140.21 v114.94,140.21 113.93,140.21 U1.11 | U24.7 262.33,18.92 v263.4,17.14 267.08,17.14 267.08,26.04 263.02,26.04 262.98,26 U24.1
  SI1 0.254: v114.94,140.21 v153.16,140.21 | v153.16,78.11 v250.06,78.11
  SI2 0.254: v153.16,140.21 v153.16,78.11 | v250.06,78.11 250.06,17.14 v263.4,17.14
KNX_TRIG  (via drill 0.6)
  Top 0.254: U13.5 248.67,32.34 v248.67,36.83
  SI1 0.254: J21.7 v248.67,36.83 v237.36,36.83
  SI2 0.254: v237.36,36.83 237.36,44.2 MD6.22
KNX_TX  (via drill 0.6)
  Top 0.254: U24.5 260.99,20.71 260.99,17.27 v259.59,16.13 | v119.3,151.31 118.05,150.19 118.05,149.89 118.04,149.86 U8.2
  SI1 0.254: v274.95,48.9 246.25,48.9 MD6.16 | v246.38,81.66 v136.91,81.66
  SI2 0.254: v259.59,16.13 274.95,16.13 v274.95,48.9 | MD6.16 v246.38,81.66 | v136.91,81.66 119.38,81.66 v119.3,151.31
KNX_V2
  SI2 0.254: MD6.1 266.45,42.8 266.45,44.83 272.92,44.83 272.92,21.59 J21.1
KNX_V20V
  SI2 0.254: MD6.3 261.49,41.53 267.33,41.53 267.33,43.94 271.91,43.94 271.91,24.13 J21.2
KNX_XCLK  (via drill 0.6)
  SI1 0.254: v266.32,38.73 v251.33,38.73
  SI2 0.254: J21.6 266.32,34.29 v266.32,38.73 | v251.33,38.73 MD6.11
KNX_XCLKC
  SI2 0.254: J23.1 234.82,20.57 234.82,26.67 238.63,26.67 MD6.21
LCD_DATA0  (via drill 0.5, 0.6)
  SI1 0.254: v268.35,134.37 258.19,140.72 239.52,140.72 238.63,140.08 202.56,140.08 189.48,126.11 94.49,104.39 94.36,104.39 v88.77,100.08
  Bottom 0.203: MD2.24 89.62,84.01 89.62,86.93
  Bottom 0.254: R1.1 v268.35,134.37 | 89.62,86.93 89.28,89.15 90.81,92.46 90.81,97.66 v88.77,100.08
LCD_DATA1  (via drill 0.5, 0.6)
  SI1 0.254: v268.35,119.76 260.99,113.03 236.09,113.03 236.09,113.41 193.04,113.41 108.08,92.71 101.09,88.01 92.96,88.01 v90.3,89.03
  Bottom 0.203: MD2.25 90.09,83.95 90.17,88.9
  Bottom 0.254: R2.2 v268.35,119.76 | 90.17,88.9 v90.3,89.03
LCD_DATA2  (via drill 0.5, 0.6)
  SI1 0.254: v265.81,134.37 257.18,140.08 239.9,140.08 239.01,139.45 203.07,139.45 189.87,125.6 95.12,103.89 95,103.89 v90.42,99.95
  Bottom 0.203: MD2.26 90.6,83.44 90.73,87.38
  Bottom 0.254: R3.1 v265.81,134.37 | 90.73,87.38 91.31,89.03 90.93,90.42 92.2,92.08 92.08,93.73 91.44,98.3 v90.42,99.95
LCD_DATA3  (via drill 0.5, 0.6)
  SI1 0.254: v265.81,119.76 259.33,113.67 236.73,113.67 236.73,114.05 193.04,114.05 107.31,93.34 100.84,88.9 93.34,89.03 v92.08,89.66
  Bottom 0.203: MD2.27 91.15,84.98 91.19,85.6 91.31,87.25 91.44,87.63
  Bottom 0.254: R4.2 v265.81,119.76 | 91.44,87.63 91.82,88.65 v92.08,89.66
LCD_DATA4  (via drill 0.5, 0.6)
  SI1 0.254: v263.27,134.37 255.65,139.45 240.41,139.45 239.52,138.81 203.58,138.81 190.25,124.97 95.63,103.38 v91.95,99.82
  Bottom 0.203: MD2.28 91.62,84.66 91.9,87.02
  Bottom 0.254: R5.1 v263.27,134.37 | 91.9,87.02 92.71,88.77 93.85,91.57 93.34,93.6 v91.95,99.82
LCD_DATA5  (via drill 0.5, 0.6)
  SI1 0.254: v263.27,119.76 257.56,114.3 237.36,114.3 237.36,114.68 193.04,114.68 106.43,93.98 100.58,89.79 93.98,89.79 92.84,90.42 92.2,90.68 90.55,90.42 89.28,90.04 88.39,89.41 v84.71,86.74
  Bottom 0.203: MD2.15 85.13,83.96 85.09,85.34
  Bottom 0.254: R6.2 v263.27,119.76 | 85.09,85.34 v84.71,86.74
LCD_DATA6  (via drill 0.5, 0.6)
  SI1 0.254: v260.73,134.37 254.25,138.81 240.79,138.81 240.03,138.18 203.96,138.18 190.75,124.33 96.39,102.87 96.27,102.87 92.84,99.31 91.95,98.42 89.41,98.68 v87.76,97.54
  Bottom 0.203: 85.64,83.57 85.6,89.28
  Bottom 0.254: R7.1 v260.73,134.37 | MD2.16 85.64,83.57 | 85.6,89.28 85.34,90.3 86.49,91.95 86.74,92.96 v87.76,97.54
LCD_DATA7  (via drill 0.5, 0.6)
  SI1 0.254: v260.73,119.76 255.65,114.94 238,114.94 238,115.32 193.04,115.32 105.79,94.61 100.33,90.68 96.27,90.81 93.47,91.19 92.33,91.44 90.17,91.31 v86.36,90.04
  Bottom 0.203: 86.14,84.68 86.11,88.27
  Bottom 0.254: R8.2 v260.73,119.76 | MD2.17 86.14,84.68 | 86.11,88.27 v86.36,90.04
LCD_DATA8  (via drill 0.5, 0.6)
  SI1 0.254: v258.19,134.37 252.73,138.18 241.3,138.18 240.66,137.54 204.34,137.54 191.13,123.7 96.9,102.36 91.95,97.41 v89.79,97.41
  Bottom 0.203: MD2.18 86.61,88.14
  Bottom 0.254: R9.1 v258.19,134.37 | 86.61,88.14 87.5,90.3 87.38,91.95 v89.79,97.41
LCD_DATA9  (via drill 0.5, 0.6)
  SI1 0.254: v258.19,119.76 253.62,115.57 238.63,115.57 238.63,115.95 193.04,115.95 105.03,95.25 100.08,91.57 92.58,92.2 v88.39,91.82
  Bottom 0.203: MD2.19 87.12,87.76
  Bottom 0.254: R10.2 v258.19,119.76 | 87.12,87.76 88.27,90.42 v88.39,91.82
LCD_DATA10  (via drill 0.5, 0.6)
  SI1 0.254: v255.52,119.76 251.59,116.2 239.27,116.2 239.27,116.59 193.04,116.59 104.27,95.89 99.82,92.46 92.71,92.96 v89.53,92.84
  Bottom 0.203: 87.63,83.24 87.63,87.38
  Bottom 0.254: R12.2 255.52,121.02 v255.52,119.76 | MD2.20 87.63,83.24 | 87.63,87.38 89.53,91.57 v89.53,92.84
LCD_DATA11  (via drill 0.5, 0.6)
  SI1 0.254: v253.11,119.76 249.68,116.84 239.9,116.84 239.9,117.22 193.04,117.22 103.63,96.52 99.69,93.34 88.9,93.85 87.12,91.82 85.85,91.06 84.71,90.04 v80.64,85.98
  Bottom 0.203: MD2.8 81.61,84.72 81.28,85.34
  Bottom 0.254: R14.2 v253.11,119.76 | 81.28,85.34 v80.64,85.98
LCD_DATA12  (via drill 0.5, 0.6)
  SI1 0.254: v255.65,134.37 251.33,137.54 241.94,137.54 241.3,136.91 204.72,136.91 191.39,123.06 97.41,101.85 92.08,96.52 85.6,96.52 v85.34,96.39
  Bottom 0.203: MD2.9 82.12,84.45 82.13,84.94 81.79,85.98
  Bottom 0.254: R11.1 v255.65,134.37 | 81.79,85.98 81.28,87.76 81.79,92.84 v85.34,96.39
LCD_DATA13  (via drill 0.5, 0.6)
  SI1 0.254: v253.11,134.37 250.06,136.91 242.44,136.91 241.81,136.27 204.98,136.27 191.77,122.43 98.04,101.35 92.46,95.89 87.25,95.89 85.98,95.38 v85.6,95
  Bottom 0.203: MD2.10 82.63,84.91 82.58,85.32
  Bottom 0.254: R13.1 v253.11,134.37 | 82.58,85.32 82.17,87.76 82.55,92.33 84.58,94.23 v85.6,95
LCD_DATA14  (via drill 0.5, 0.6)
  SI1 0.254: v250.57,134.37 248.41,136.27 242.95,136.27 242.32,135.64 205.36,135.64 192.15,121.79 98.68,100.84 92.58,95.12 87.38,95.12 v85.85,93.6
  Bottom 0.203: MD2.11 83.15,83.98 83.15,85.13
  Bottom 0.254: R15.1 v250.57,134.37 | 83.15,85.13 82.93,87.76 83.31,91.57 85.47,93.6 v85.85,93.6
LCD_DATA15  (via drill 0.5, 0.6)
  SI1 0.254: v250.57,119.76 247.52,117.47 240.54,117.47 240.54,117.86 193.17,117.86 102.87,97.16 99.44,94.23 88.14,94.49 86.61,92.71 v85.34,92.2
  Bottom 0.203: MD2.12 83.63,84.76 83.74,85.2 83.82,85.6 83.69,86.87
  Bottom 0.254: R16.2 v250.57,119.76 | 83.69,86.87 84.2,90.68 85.34,91.95 v85.34,92.2